# EAGLE schematic MEM_MUX_2W_1 (EAGLE 6.5.0)

## Sheet 1 of 12
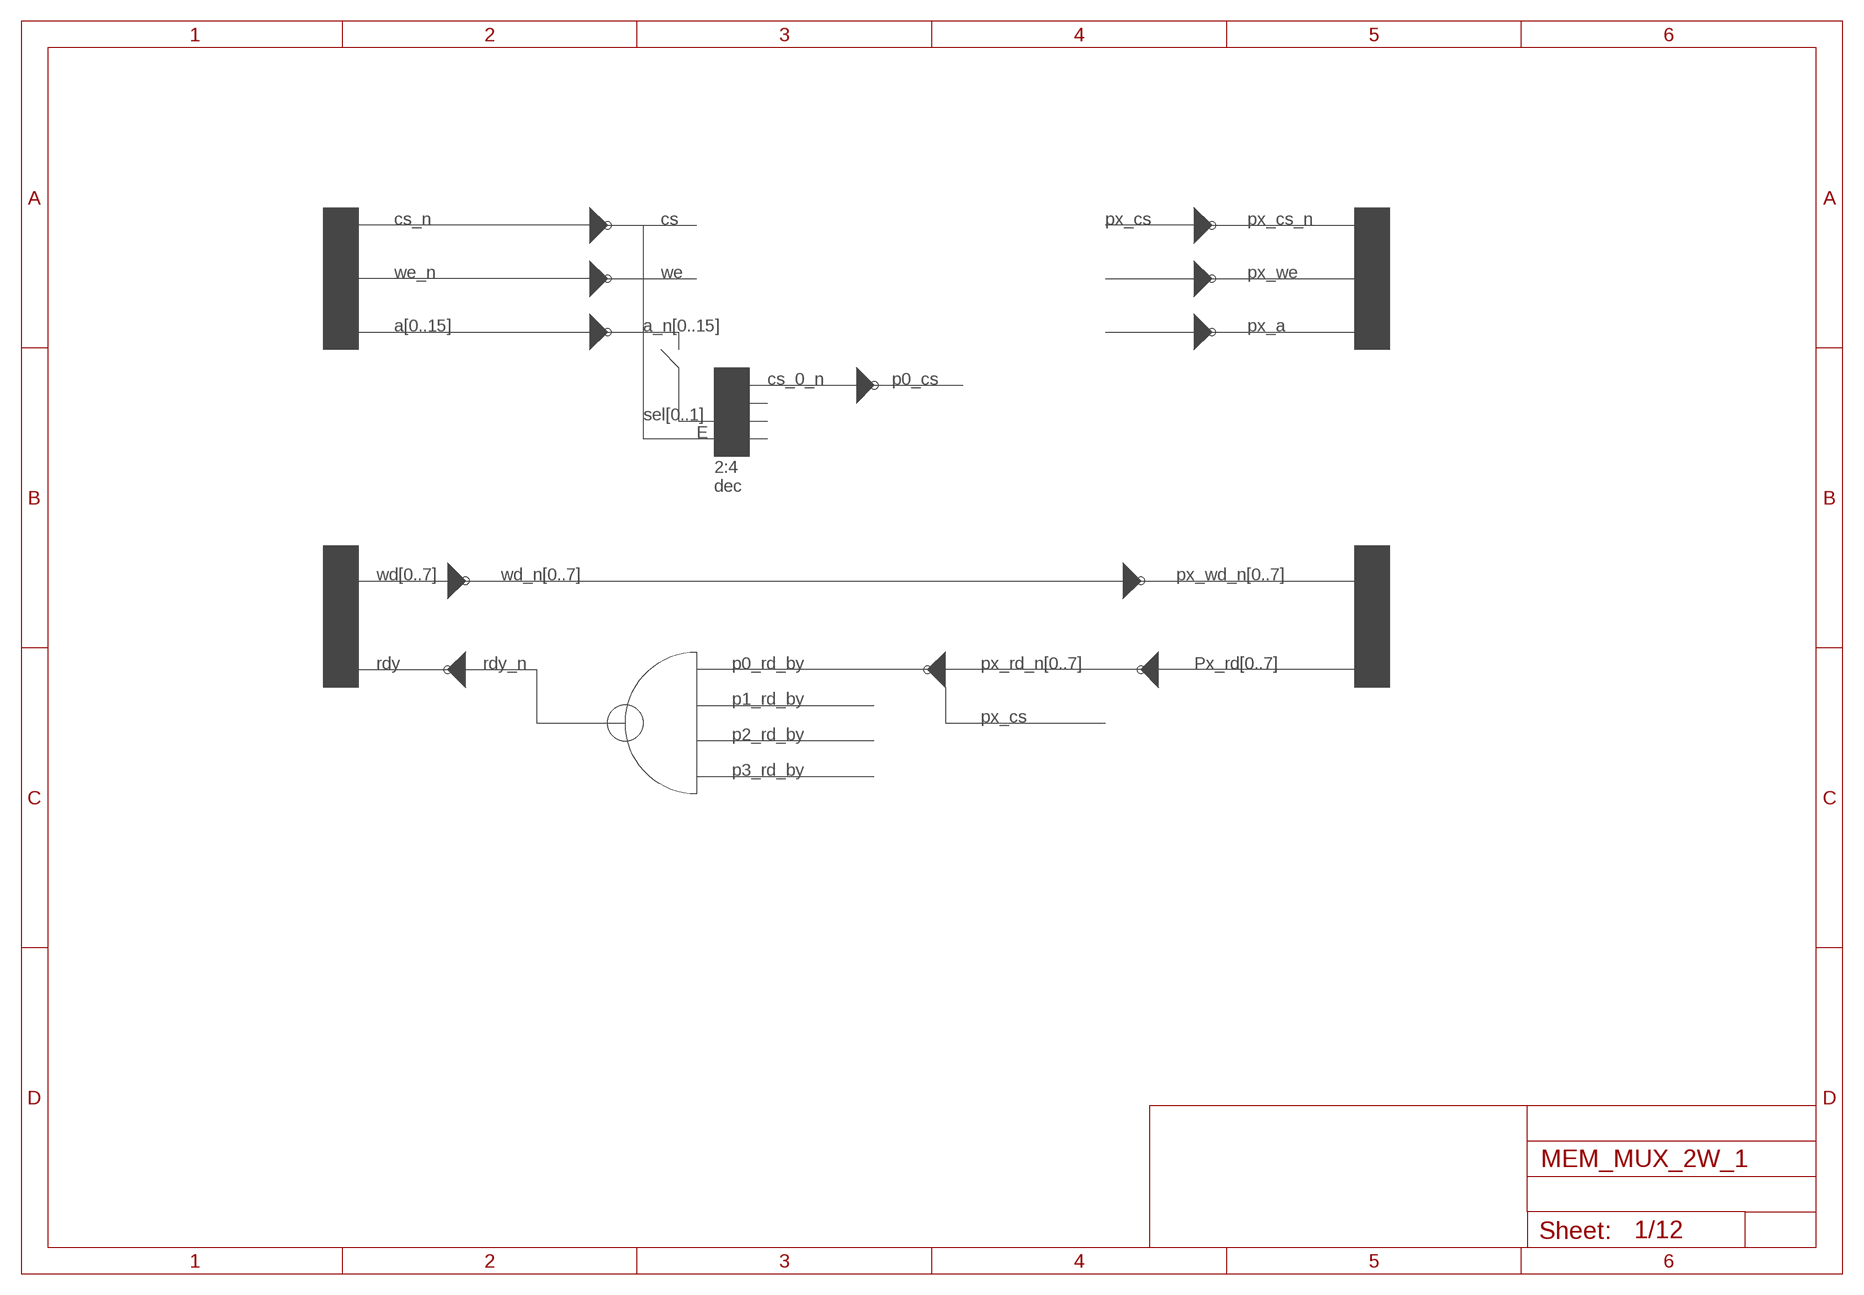
[diagram p0: schematic, sheet 1]

### Notes on the sheet
- cs_n | cs | px_cs | px_cs_n
- we_n | we | px_we
- a[0..15] | a_n[0..15] | px_a
- cs_0_n | p0_cs
- sel[0..1]
- E
- 2:4
  dec
- wd[0..7] | wd_n[0..7] | px_wd_n[0..7]
- rdy | rdy_n | p0_rd_by | px_rd_n[0..7] | Px_rd[0..7]
- p1_rd_by
- px_cs
- p2_rd_by
- p3_rd_by

## Sheet 2 of 12
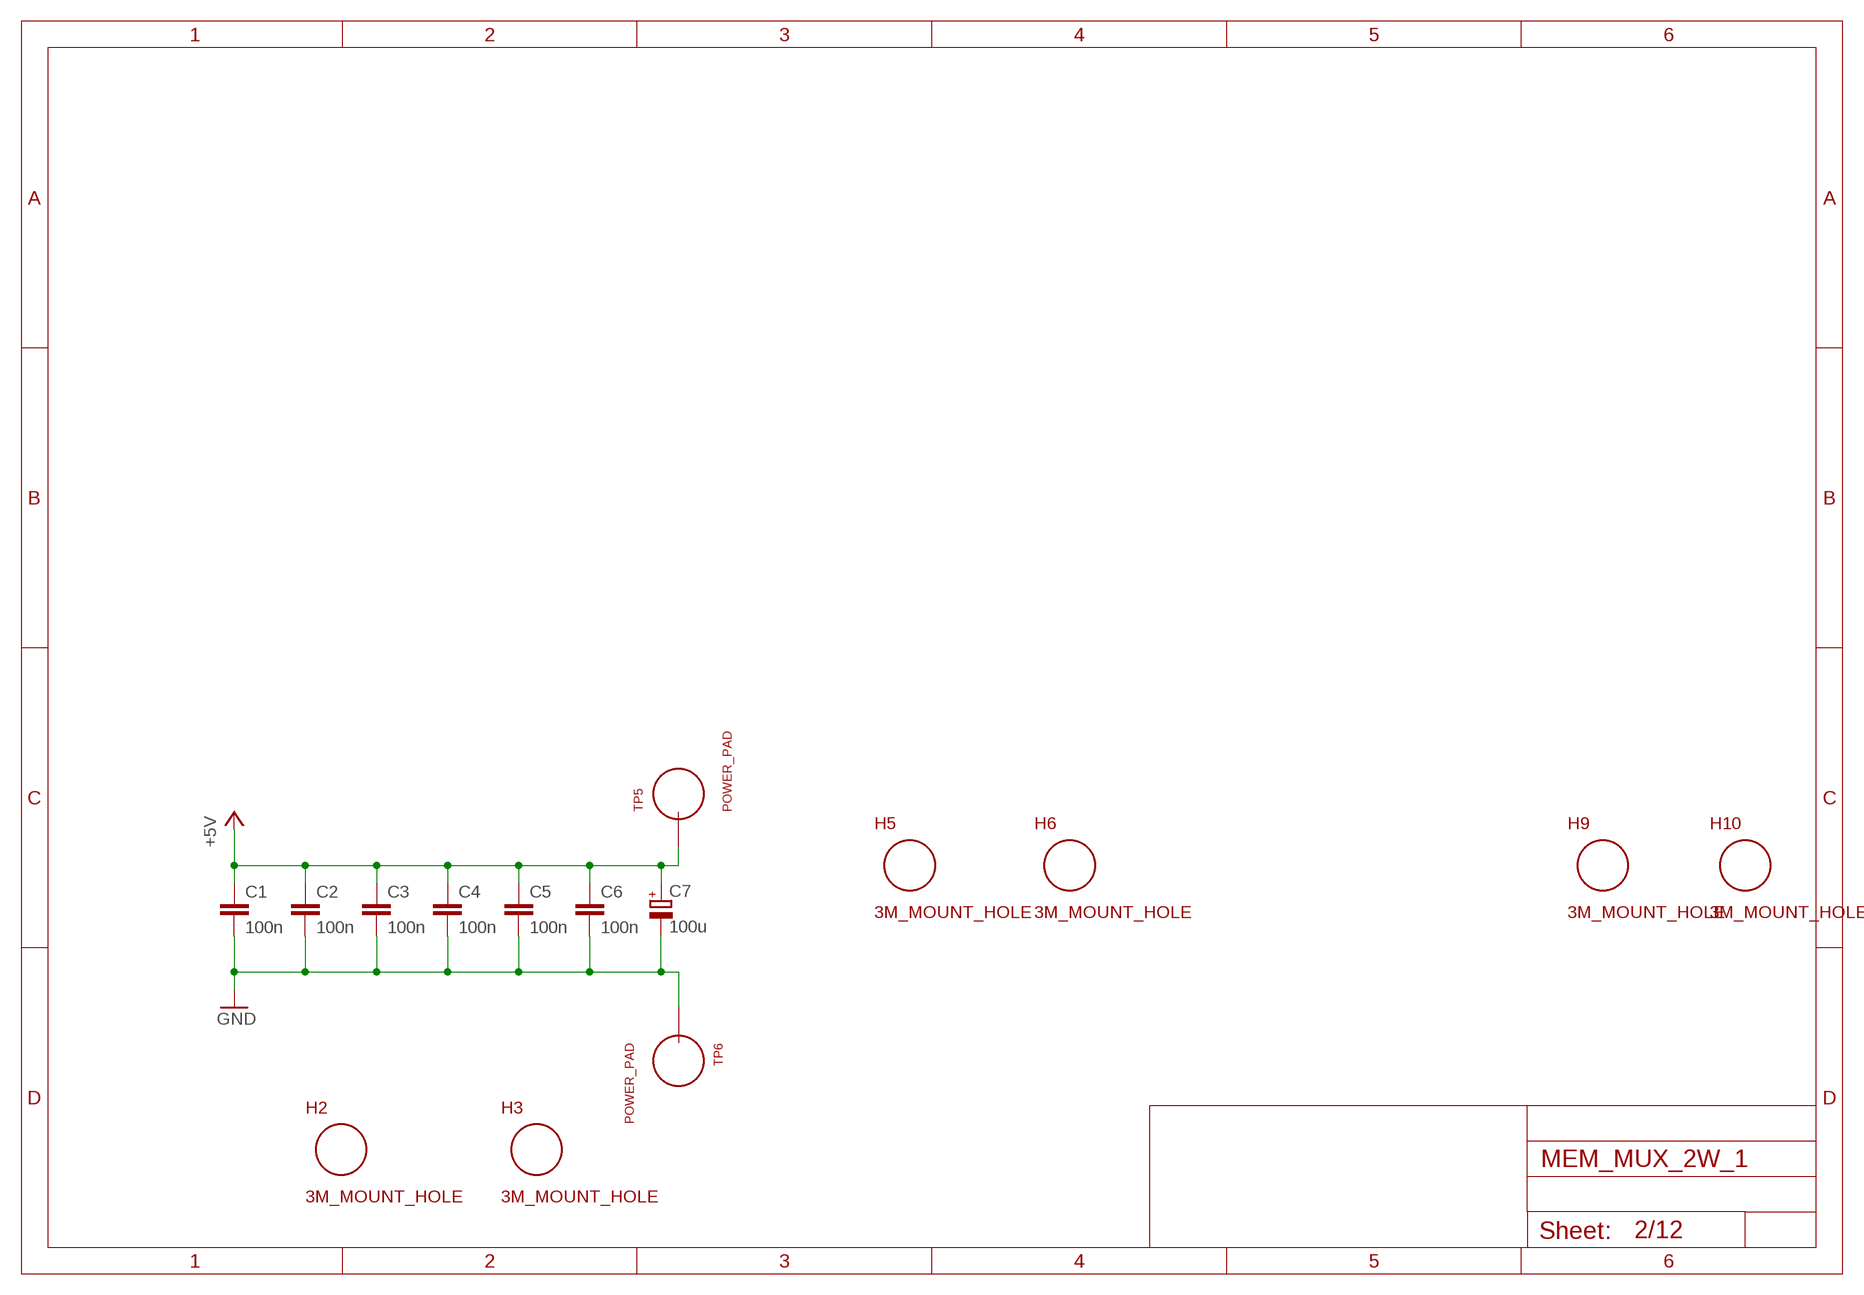
[diagram p1: schematic, sheet 2]

### Parts
C1  100n  C_P2INCH  [CAP_P2INCH]
C2  100n  C_P2INCH  [CAP_P2INCH]
C3  100n  C_P2INCH  [CAP_P2INCH]
C4  100n  C_P2INCH  [CAP_P2INCH]
C5  100n  C_P2INCH  [CAP_P2INCH]
C6  100n  C_P2INCH  [CAP_P2INCH]
C7  100u  POLARISED_CAP_2P5_6P3MM  [POLARISED_CAP_2P5_6P3MM]
H2  3M_MOUNT_HOLE  [3M_HOLE]
H3  3M_MOUNT_HOLE  [3M_HOLE]
H5  3M_MOUNT_HOLE  [3M_HOLE]
H6  3M_MOUNT_HOLE  [3M_HOLE]
H9  3M_MOUNT_HOLE  [3M_HOLE]
H10  3M_MOUNT_HOLE  [3M_HOLE]
TP5  POWER_PAD  [POWER_PAD]
TP6  POWER_PAD  [POWER_PAD]

### Nets
+5V: C1.1 C2.1 C3.1 C4.1 C5.1 C6.1 C7.A TP5.1 ; also sheet 3,4,5,6,7,8,9,10,11,12
GND: C1.2 C2.2 C3.2 C4.2 C5.2 C6.2 C7.K TP6.1 ; also sheet 3,4,5,6,7,8,9,10,11,12

## Sheet 3 of 12
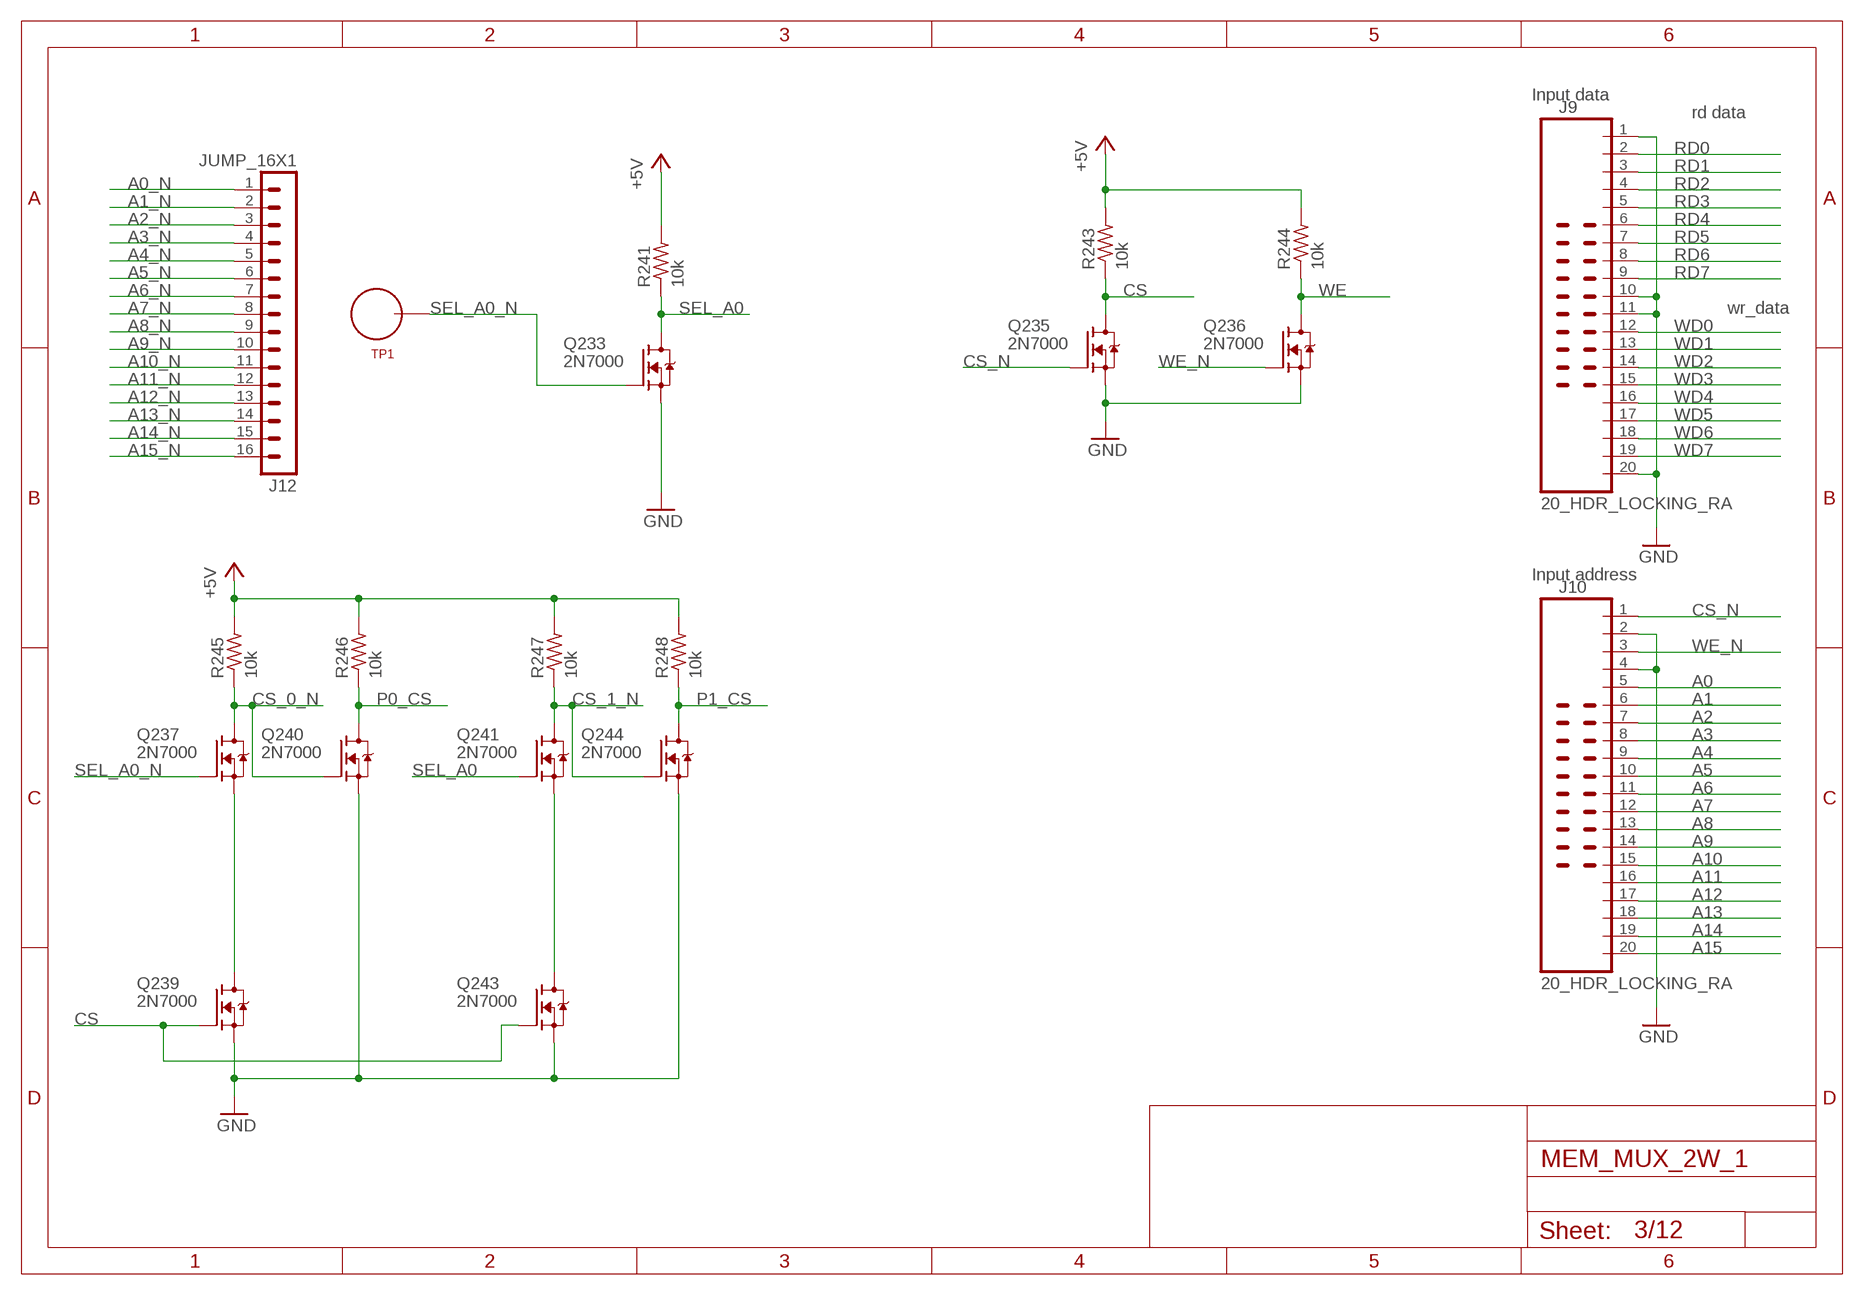
[diagram p2: schematic, sheet 3]

### Parts
J9  20_HDR_LOCKING_RA  [20_HDR_LOCKING_RA]
J10  20_HDR_LOCKING_RA  [20_HDR_LOCKING_RA]
J12  JUMP_16X1  [JUMP_16X1]
Q233  2N7000  [TO92-DGS]
Q235  2N7000  [TO92-DGS]
Q236  2N7000  [TO92-DGS]
Q237  2N7000  [TO92-DGS]
Q239  2N7000  [TO92-DGS]
Q240  2N7000  [TO92-DGS]
Q241  2N7000  [TO92-DGS]
Q243  2N7000  [TO92-DGS]
Q244  2N7000  [TO92-DGS]
R241  10k  R_P2INCH  [R_P2INCH]
R243  10k  R_P2INCH  [R_P2INCH]
R244  10k  R_P2INCH  [R_P2INCH]
R245  10k  R_P2INCH  [R_P2INCH]
R246  10k  R_P2INCH  [R_P2INCH]
R247  10k  R_P2INCH  [R_P2INCH]
R248  10k  R_P2INCH  [R_P2INCH]
TP1  TEST_LOOP  [TEST_LOOP]

### Nets
+5V: R241.2 R243.2 R244.2 R245.2 R246.2 R247.2 R248.2 ; also sheet 2,4,5,6,7,8,9,10,11,12
A0: J10.5 ; also sheet 4
A0_N: J12.1 ; also sheet 4,7,10
A1: J10.6 ; also sheet 4
A1_N: J12.2 ; also sheet 4,7,10
A2: J10.7 ; also sheet 4
A2_N: J12.3 ; also sheet 4,7,10
A3: J10.8 ; also sheet 4
A3_N: J12.4 ; also sheet 4,7,10
A4: J10.9 ; also sheet 4
A4_N: J12.5 ; also sheet 4,7,10
A5: J10.10 ; also sheet 4
A5_N: J12.6 ; also sheet 4,7,10
A6: J10.11 ; also sheet 4
A6_N: J12.7 ; also sheet 4,7,10
A7: J10.12 ; also sheet 4
A7_N: J12.8 ; also sheet 4,7,10
A8: J10.13 ; also sheet 4
A8_N: J12.9 ; also sheet 4,7,10
A9: J10.14 ; also sheet 4
A9_N: J12.10 ; also sheet 4,7,10
A10: J10.15 ; also sheet 4
A10_N: J12.11 ; also sheet 4,7,10
A11: J10.16 ; also sheet 4
A11_N: J12.12 ; also sheet 4,7,10
A12: J10.17 ; also sheet 4
A12_N: J12.13 ; also sheet 4,7,10
A13: J10.18 ; also sheet 4
A13_N: J12.14 ; also sheet 4,7,10
A14: J10.19 ; also sheet 4
A14_N: J12.15 ; also sheet 4,7,10
A15: J10.20 ; also sheet 4
A15_N: J12.16 ; also sheet 4,7,10
CS: Q235.D Q239.G Q243.G R243.1
CS_0_N: Q237.D Q240.G R245.1 ; also sheet 5
CS_1_N: Q241.D Q244.G R247.1 ; also sheet 8
CS_N: J10.1 Q235.G
GND: J9.1 J9.10 J9.11 J9.20 J10.2 J10.4 Q233.S Q235.S Q236.S Q239.S Q240.S Q243.S Q244.S ; also sheet 2,4,5,6,7,8,9,10,11,12
N$33: Q237.S Q239.D
N$34: Q241.S Q243.D
P0_CS: Q240.D R246.1 ; also sheet 6
P1_CS: Q244.D R248.1 ; also sheet 9
RD0: J9.2 ; also sheet 11
RD1: J9.3 ; also sheet 11
RD2: J9.4 ; also sheet 11
RD3: J9.5 ; also sheet 11
RD4: J9.6 ; also sheet 12
RD5: J9.7 ; also sheet 12
RD6: J9.8 ; also sheet 12
RD7: J9.9 ; also sheet 12
SEL_A0: Q233.D Q241.G R241.1
SEL_A0_N: Q233.G Q237.G TP1.P$1
WD0: J9.12 ; also sheet 4
WD1: J9.13 ; also sheet 4
WD2: J9.14 ; also sheet 4
WD3: J9.15 ; also sheet 4
WD4: J9.16 ; also sheet 4
WD5: J9.17 ; also sheet 4
WD6: J9.18 ; also sheet 4
WD7: J9.19 ; also sheet 4
WE: Q236.D R244.1 ; also sheet 6,9
WE_N: J10.3 Q236.G

### Notes on the sheet
- Input data
- rd data
- wr_data
- Input address

## Sheet 4 of 12
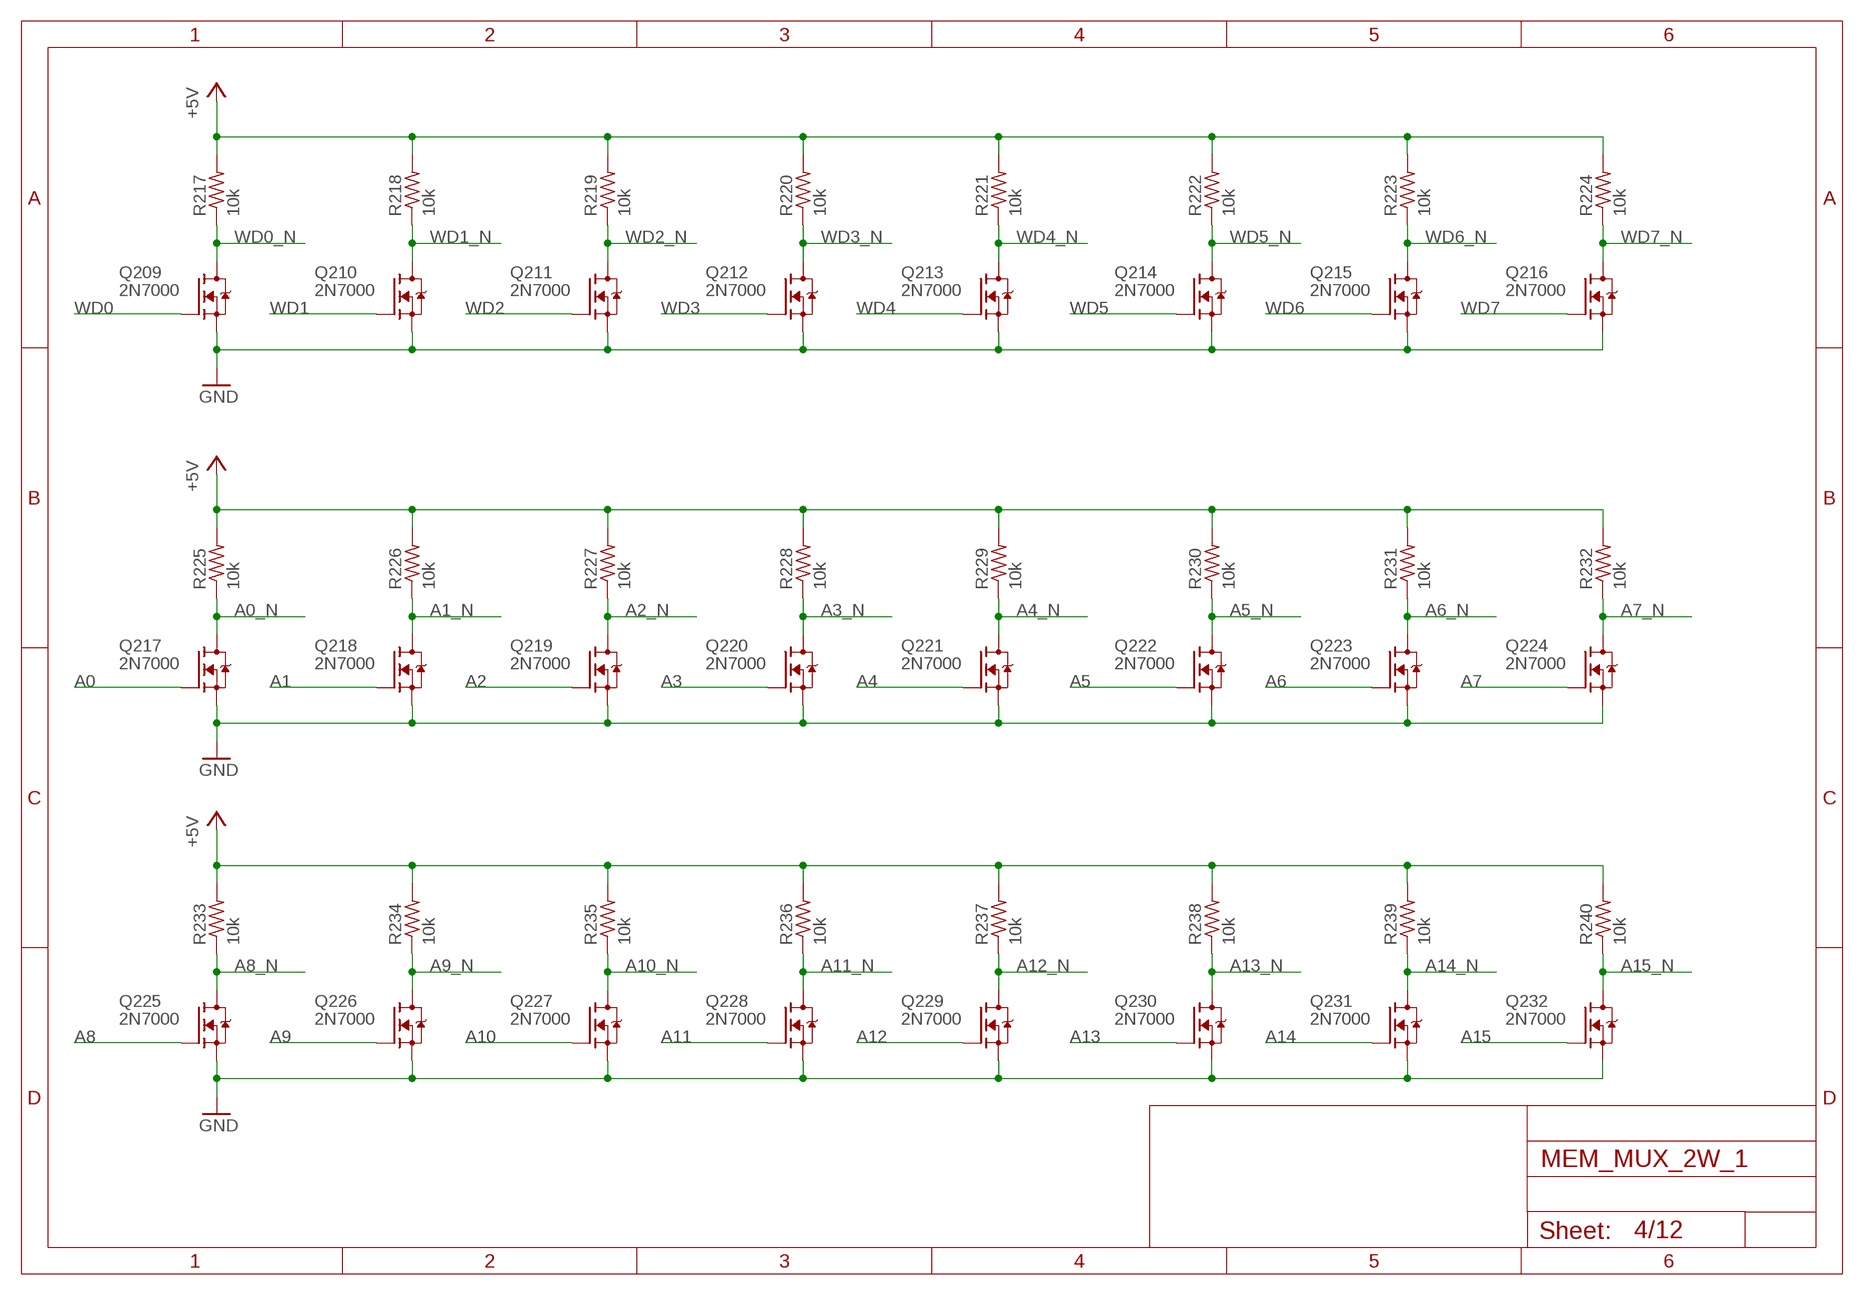
[diagram p3: schematic, sheet 4]

### Parts
Q209  2N7000  [TO92-DGS]
Q210  2N7000  [TO92-DGS]
Q211  2N7000  [TO92-DGS]
Q212  2N7000  [TO92-DGS]
Q213  2N7000  [TO92-DGS]
Q214  2N7000  [TO92-DGS]
Q215  2N7000  [TO92-DGS]
Q216  2N7000  [TO92-DGS]
Q217  2N7000  [TO92-DGS]
Q218  2N7000  [TO92-DGS]
Q219  2N7000  [TO92-DGS]
Q220  2N7000  [TO92-DGS]
Q221  2N7000  [TO92-DGS]
Q222  2N7000  [TO92-DGS]
Q223  2N7000  [TO92-DGS]
Q224  2N7000  [TO92-DGS]
Q225  2N7000  [TO92-DGS]
Q226  2N7000  [TO92-DGS]
Q227  2N7000  [TO92-DGS]
Q228  2N7000  [TO92-DGS]
Q229  2N7000  [TO92-DGS]
Q230  2N7000  [TO92-DGS]
Q231  2N7000  [TO92-DGS]
Q232  2N7000  [TO92-DGS]
R217  10k  R_P2INCH  [R_P2INCH]
R218  10k  R_P2INCH  [R_P2INCH]
R219  10k  R_P2INCH  [R_P2INCH]
R220  10k  R_P2INCH  [R_P2INCH]
R221  10k  R_P2INCH  [R_P2INCH]
R222  10k  R_P2INCH  [R_P2INCH]
R223  10k  R_P2INCH  [R_P2INCH]
R224  10k  R_P2INCH  [R_P2INCH]
R225  10k  R_P2INCH  [R_P2INCH]
R226  10k  R_P2INCH  [R_P2INCH]
R227  10k  R_P2INCH  [R_P2INCH]
R228  10k  R_P2INCH  [R_P2INCH]
R229  10k  R_P2INCH  [R_P2INCH]
R230  10k  R_P2INCH  [R_P2INCH]
R231  10k  R_P2INCH  [R_P2INCH]
R232  10k  R_P2INCH  [R_P2INCH]
R233  10k  R_P2INCH  [R_P2INCH]
R234  10k  R_P2INCH  [R_P2INCH]
R235  10k  R_P2INCH  [R_P2INCH]
R236  10k  R_P2INCH  [R_P2INCH]
R237  10k  R_P2INCH  [R_P2INCH]
R238  10k  R_P2INCH  [R_P2INCH]
R239  10k  R_P2INCH  [R_P2INCH]
R240  10k  R_P2INCH  [R_P2INCH]

### Nets
+5V: R217.2 R218.2 R219.2 R220.2 R221.2 R222.2 R223.2 R224.2 R225.2 R226.2 R227.2 R228.2 R229.2 R230.2 R231.2 R232.2 R233.2 R234.2 R235.2 R236.2 R237.2 R238.2 R239.2 R240.2 ; also sheet 2,3,5,6,7,8,9,10,11,12
A0: Q217.G ; also sheet 3
A0_N: Q217.D R225.1 ; also sheet 3,7,10
A1: Q218.G ; also sheet 3
A1_N: Q218.D R226.1 ; also sheet 3,7,10
A2: Q219.G ; also sheet 3
A2_N: Q219.D R227.1 ; also sheet 3,7,10
A3: Q220.G ; also sheet 3
A3_N: Q220.D R228.1 ; also sheet 3,7,10
A4: Q221.G ; also sheet 3
A4_N: Q221.D R229.1 ; also sheet 3,7,10
A5: Q222.G ; also sheet 3
A5_N: Q222.D R230.1 ; also sheet 3,7,10
A6: Q223.G ; also sheet 3
A6_N: Q223.D R231.1 ; also sheet 3,7,10
A7: Q224.G ; also sheet 3
A7_N: Q224.D R232.1 ; also sheet 3,7,10
A8: Q225.G ; also sheet 3
A8_N: Q225.D R233.1 ; also sheet 3,7,10
A9: Q226.G ; also sheet 3
A9_N: Q226.D R234.1 ; also sheet 3,7,10
A10: Q227.G ; also sheet 3
A10_N: Q227.D R235.1 ; also sheet 3,7,10
A11: Q228.G ; also sheet 3
A11_N: Q228.D R236.1 ; also sheet 3,7,10
A12: Q229.G ; also sheet 3
A12_N: Q229.D R237.1 ; also sheet 3,7,10
A13: Q230.G ; also sheet 3
A13_N: Q230.D R238.1 ; also sheet 3,7,10
A14: Q231.G ; also sheet 3
A14_N: Q231.D R239.1 ; also sheet 3,7,10
A15: Q232.G ; also sheet 3
A15_N: Q232.D R240.1 ; also sheet 3,7,10
GND: Q209.S Q210.S Q211.S Q212.S Q213.S Q214.S Q215.S Q216.S Q217.S Q218.S Q219.S Q220.S Q221.S Q222.S Q223.S Q224.S Q225.S Q226.S Q227.S Q228.S Q229.S Q230.S Q231.S Q232.S ; also sheet 2,3,5,6,7,8,9,10,11,12
WD0: Q209.G ; also sheet 3
WD0_N: Q209.D R217.1 ; also sheet 7,10
WD1: Q210.G ; also sheet 3
WD1_N: Q210.D R218.1 ; also sheet 7,10
WD2: Q211.G ; also sheet 3
WD2_N: Q211.D R219.1 ; also sheet 7,10
WD3: Q212.G ; also sheet 3
WD3_N: Q212.D R220.1 ; also sheet 7,10
WD4: Q213.G ; also sheet 3
WD4_N: Q213.D R221.1 ; also sheet 7,10
WD5: Q214.G ; also sheet 3
WD5_N: Q214.D R222.1 ; also sheet 7,10
WD6: Q215.G ; also sheet 3
WD6_N: Q215.D R223.1 ; also sheet 7,10
WD7: Q216.G ; also sheet 3
WD7_N: Q216.D R224.1 ; also sheet 7,10

## Sheet 5 of 12
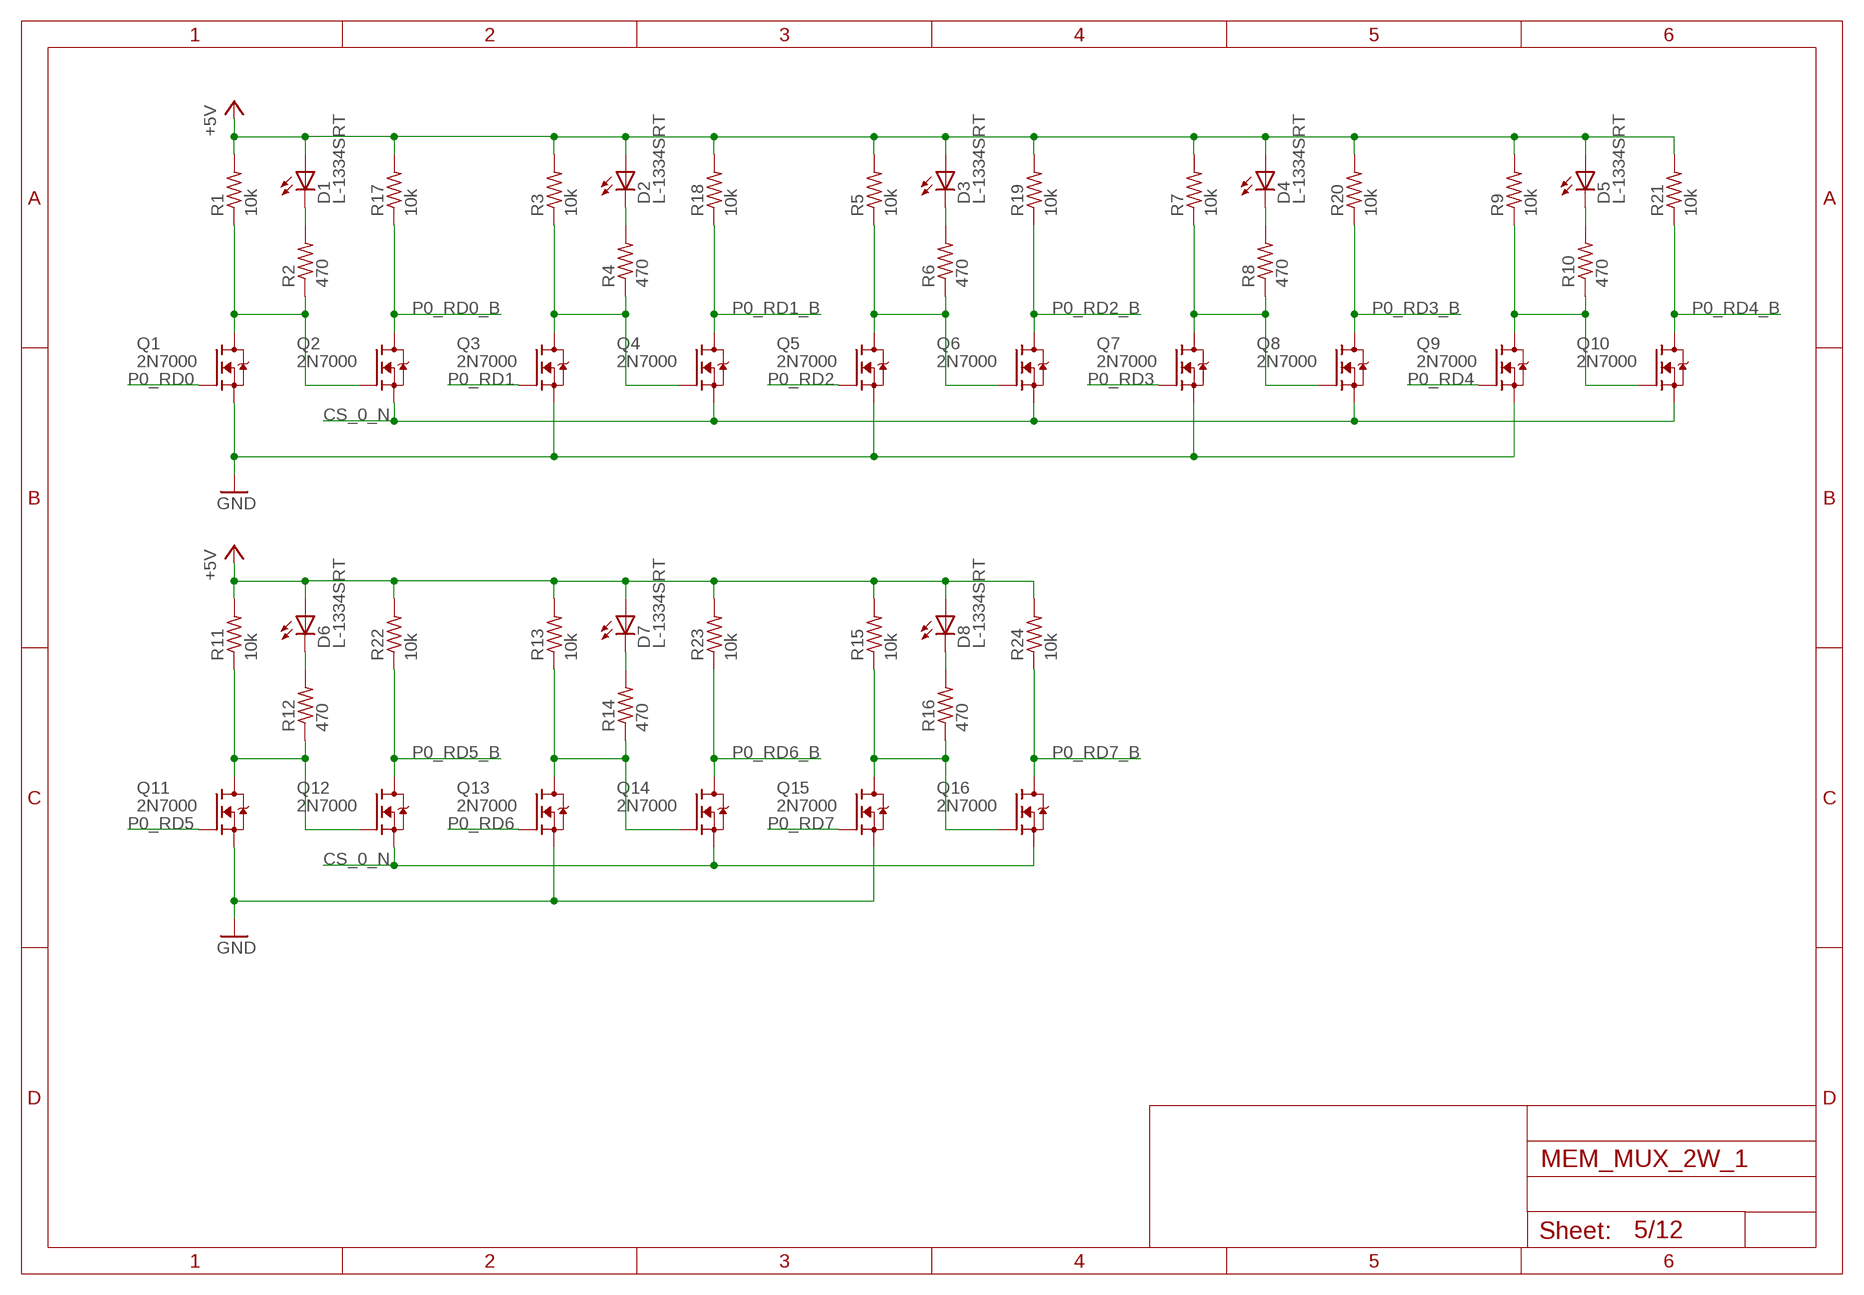
[diagram p4: schematic, sheet 5]

### Parts
D1  L-1334SRT  [LED3MM]
D2  L-1334SRT  [LED3MM]
D3  L-1334SRT  [LED3MM]
D4  L-1334SRT  [LED3MM]
D5  L-1334SRT  [LED3MM]
D6  L-1334SRT  [LED3MM]
D7  L-1334SRT  [LED3MM]
D8  L-1334SRT  [LED3MM]
Q1  2N7000  [TO92-DGS]
Q2  2N7000  [TO92-DGS]
Q3  2N7000  [TO92-DGS]
Q4  2N7000  [TO92-DGS]
Q5  2N7000  [TO92-DGS]
Q6  2N7000  [TO92-DGS]
Q7  2N7000  [TO92-DGS]
Q8  2N7000  [TO92-DGS]
Q9  2N7000  [TO92-DGS]
Q10  2N7000  [TO92-DGS]
Q11  2N7000  [TO92-DGS]
Q12  2N7000  [TO92-DGS]
Q13  2N7000  [TO92-DGS]
Q14  2N7000  [TO92-DGS]
Q15  2N7000  [TO92-DGS]
Q16  2N7000  [TO92-DGS]
R1  10k  R_P2INCH  [R_P2INCH]
R2  470  R_P2INCH  [R_P2INCH]
R3  10k  R_P2INCH  [R_P2INCH]
R4  470  R_P2INCH  [R_P2INCH]
R5  10k  R_P2INCH  [R_P2INCH]
R6  470  R_P2INCH  [R_P2INCH]
R7  10k  R_P2INCH  [R_P2INCH]
R8  470  R_P2INCH  [R_P2INCH]
R9  10k  R_P2INCH  [R_P2INCH]
R10  470  R_P2INCH  [R_P2INCH]
R11  10k  R_P2INCH  [R_P2INCH]
R12  470  R_P2INCH  [R_P2INCH]
R13  10k  R_P2INCH  [R_P2INCH]
R14  470  R_P2INCH  [R_P2INCH]
R15  10k  R_P2INCH  [R_P2INCH]
R16  470  R_P2INCH  [R_P2INCH]
R17  10k  R_P2INCH  [R_P2INCH]
R18  10k  R_P2INCH  [R_P2INCH]
R19  10k  R_P2INCH  [R_P2INCH]
R20  10k  R_P2INCH  [R_P2INCH]
R21  10k  R_P2INCH  [R_P2INCH]
R22  10k  R_P2INCH  [R_P2INCH]
R23  10k  R_P2INCH  [R_P2INCH]
R24  10k  R_P2INCH  [R_P2INCH]

### Nets
+5V: D1.A D2.A D3.A D4.A D5.A D6.A D7.A D8.A R1.2 R3.2 R5.2 R7.2 R9.2 R11.2 R13.2 R15.2 R17.2 R18.2 R19.2 R20.2 R21.2 R22.2 R23.2 R24.2 ; also sheet 2,3,4,6,7,8,9,10,11,12
CS_0_N: Q2.S Q4.S Q6.S Q8.S Q10.S Q12.S Q14.S Q16.S ; also sheet 3
GND: Q1.S Q3.S Q5.S Q7.S Q9.S Q11.S Q13.S Q15.S ; also sheet 2,3,4,6,7,8,9,10,11,12
N$1: Q3.D Q4.G R3.1 R4.1
N$2: Q1.D Q2.G R1.1 R2.1
N$3: D1.K(C) R2.2
N$4: D2.K(C) R4.2
N$5: Q5.D Q6.G R5.1 R6.1
N$6: D3.K(C) R6.2
N$7: Q7.D Q8.G R7.1 R8.1
N$8: D4.K(C) R8.2
N$9: Q9.D Q10.G R9.1 R10.1
N$10: D5.K(C) R10.2
N$12: Q11.D Q12.G R11.1 R12.1
N$13: D6.K(C) R12.2
N$14: Q13.D Q14.G R13.1 R14.1
N$15: D7.K(C) R14.2
N$16: Q15.D Q16.G R15.1 R16.1
N$17: D8.K(C) R16.2
P0_RD0: Q1.G ; also sheet 6
P0_RD0_B: Q2.D R17.1 ; also sheet 11
P0_RD1: Q3.G ; also sheet 6
P0_RD1_B: Q4.D R18.1 ; also sheet 11
P0_RD2: Q5.G ; also sheet 6
P0_RD2_B: Q6.D R19.1 ; also sheet 11
P0_RD3: Q7.G ; also sheet 6
P0_RD3_B: Q8.D R20.1 ; also sheet 11
P0_RD4: Q9.G ; also sheet 6
P0_RD4_B: Q10.D R21.1 ; also sheet 12
P0_RD5: Q11.G ; also sheet 6
P0_RD5_B: Q12.D R22.1 ; also sheet 12
P0_RD6: Q13.G ; also sheet 6
P0_RD6_B: Q14.D R23.1 ; also sheet 12
P0_RD7: Q15.G ; also sheet 6
P0_RD7_B: Q16.D R24.1 ; also sheet 12

## Sheet 6 of 12
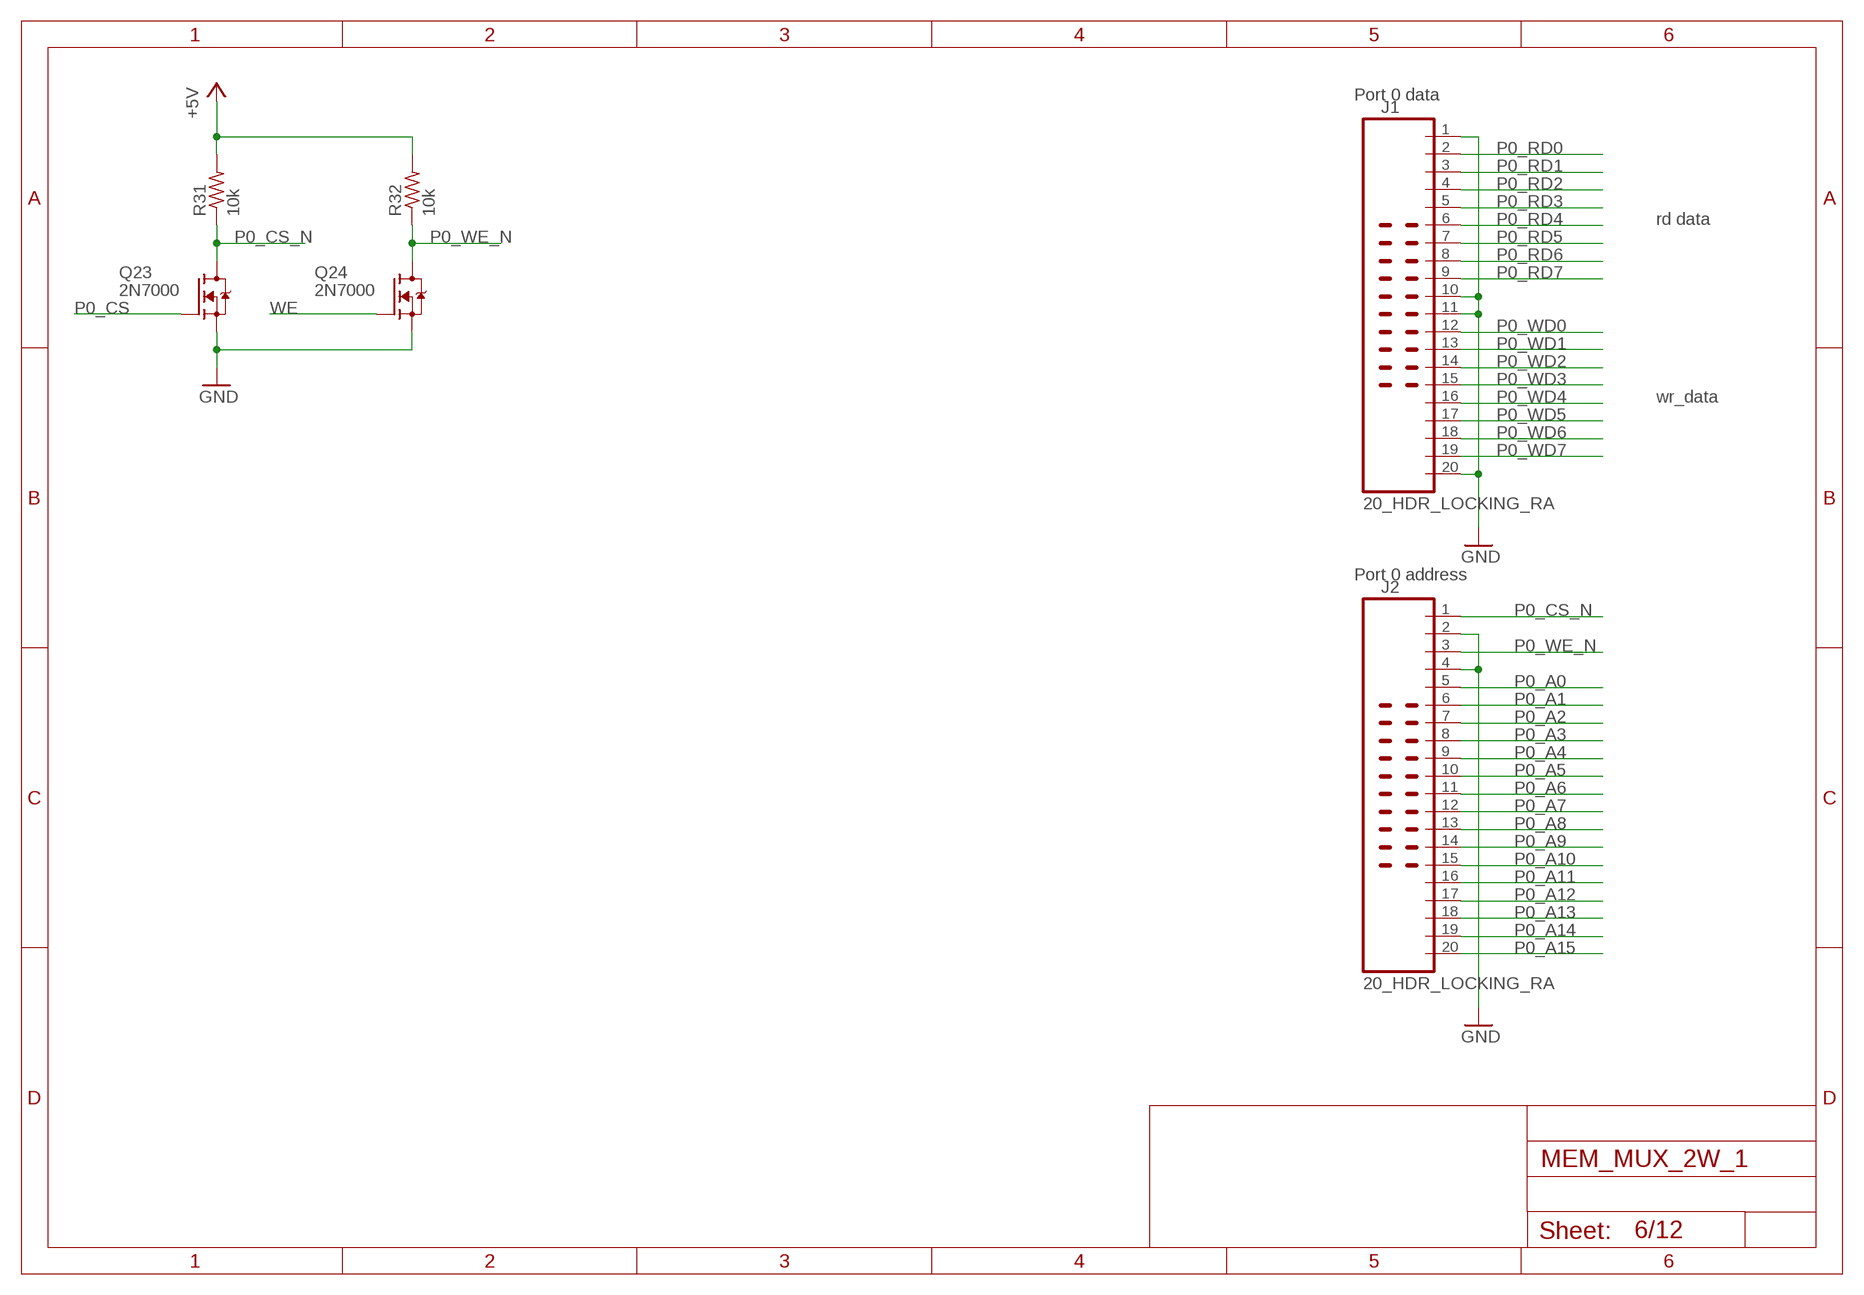
[diagram p5: schematic, sheet 6]

### Parts
J1  20_HDR_LOCKING_RA  [20_HDR_LOCKING_RA]
J2  20_HDR_LOCKING_RA  [20_HDR_LOCKING_RA]
Q23  2N7000  [TO92-DGS]
Q24  2N7000  [TO92-DGS]
R31  10k  R_P2INCH  [R_P2INCH]
R32  10k  R_P2INCH  [R_P2INCH]

### Nets
+5V: R31.2 R32.2 ; also sheet 2,3,4,5,7,8,9,10,11,12
GND: J1.1 J1.10 J1.11 J1.20 J2.2 J2.4 Q23.S Q24.S ; also sheet 2,3,4,5,7,8,9,10,11,12
P0_A0: J2.5 ; also sheet 7
P0_A1: J2.6 ; also sheet 7
P0_A2: J2.7 ; also sheet 7
P0_A3: J2.8 ; also sheet 7
P0_A4: J2.9 ; also sheet 7
P0_A5: J2.10 ; also sheet 7
P0_A6: J2.11 ; also sheet 7
P0_A7: J2.12 ; also sheet 7
P0_A8: J2.13 ; also sheet 7
P0_A9: J2.14 ; also sheet 7
P0_A10: J2.15 ; also sheet 7
P0_A11: J2.16 ; also sheet 7
P0_A12: J2.17 ; also sheet 7
P0_A13: J2.18 ; also sheet 7
P0_A14: J2.19 ; also sheet 7
P0_A15: J2.20 ; also sheet 7
P0_CS: Q23.G ; also sheet 3
P0_CS_N: J2.1 Q23.D R31.1
P0_RD0: J1.2 ; also sheet 5
P0_RD1: J1.3 ; also sheet 5
P0_RD2: J1.4 ; also sheet 5
P0_RD3: J1.5 ; also sheet 5
P0_RD4: J1.6 ; also sheet 5
P0_RD5: J1.7 ; also sheet 5
P0_RD6: J1.8 ; also sheet 5
P0_RD7: J1.9 ; also sheet 5
P0_WD0: J1.12 ; also sheet 7
P0_WD1: J1.13 ; also sheet 7
P0_WD2: J1.14 ; also sheet 7
P0_WD3: J1.15 ; also sheet 7
P0_WD4: J1.16 ; also sheet 7
P0_WD5: J1.17 ; also sheet 7
P0_WD6: J1.18 ; also sheet 7
P0_WD7: J1.19 ; also sheet 7
P0_WE_N: J2.3 Q24.D R32.1
WE: Q24.G ; also sheet 3,9

### Notes on the sheet
- Port 0 data
- rd data
- wr_data
- Port 0 address

## Sheet 7 of 12
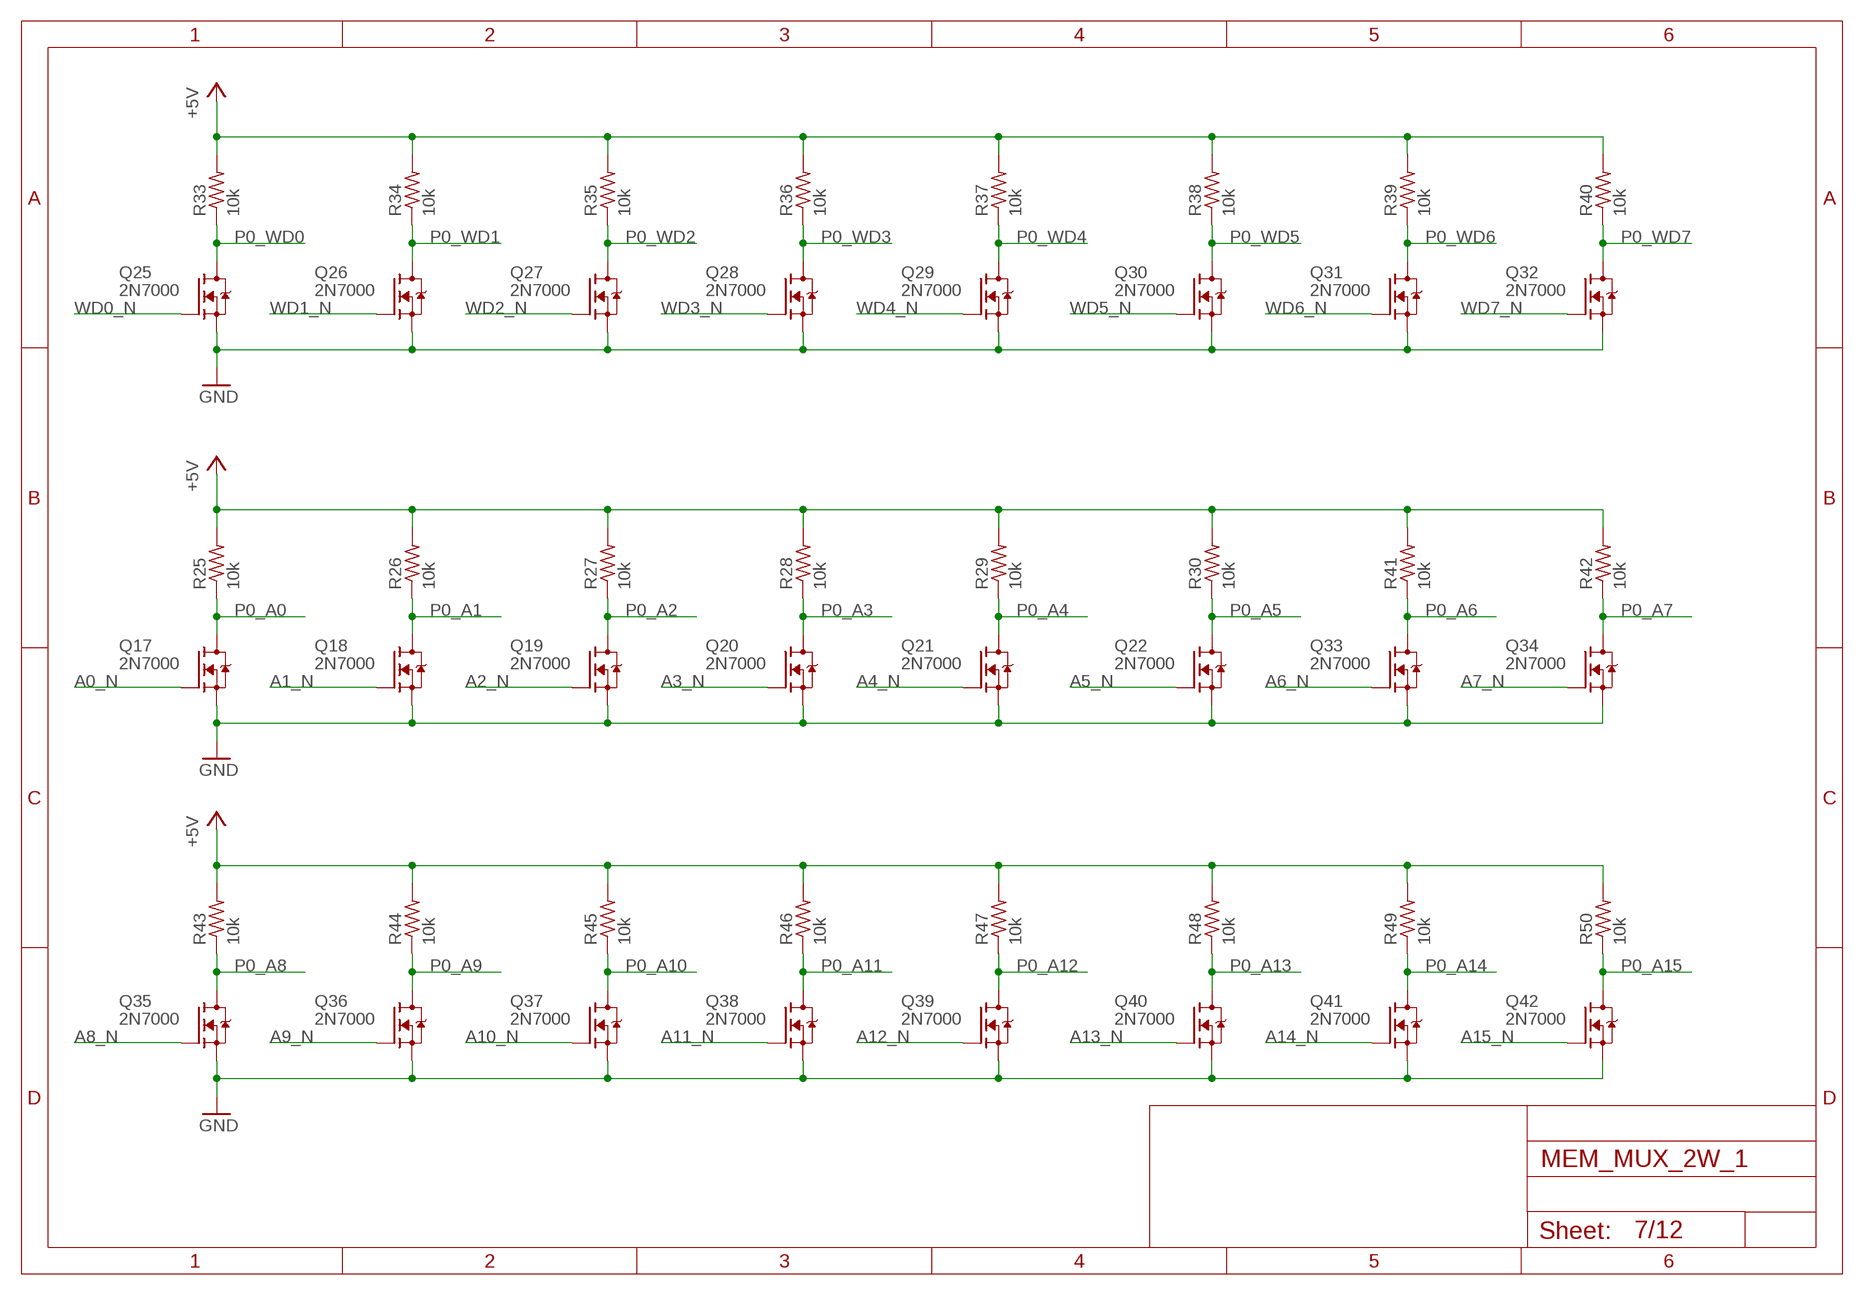
[diagram p6: schematic, sheet 7]

### Parts
Q17  2N7000  [TO92-DGS]
Q18  2N7000  [TO92-DGS]
Q19  2N7000  [TO92-DGS]
Q20  2N7000  [TO92-DGS]
Q21  2N7000  [TO92-DGS]
Q22  2N7000  [TO92-DGS]
Q25  2N7000  [TO92-DGS]
Q26  2N7000  [TO92-DGS]
Q27  2N7000  [TO92-DGS]
Q28  2N7000  [TO92-DGS]
Q29  2N7000  [TO92-DGS]
Q30  2N7000  [TO92-DGS]
Q31  2N7000  [TO92-DGS]
Q32  2N7000  [TO92-DGS]
Q33  2N7000  [TO92-DGS]
Q34  2N7000  [TO92-DGS]
Q35  2N7000  [TO92-DGS]
Q36  2N7000  [TO92-DGS]
Q37  2N7000  [TO92-DGS]
Q38  2N7000  [TO92-DGS]
Q39  2N7000  [TO92-DGS]
Q40  2N7000  [TO92-DGS]
Q41  2N7000  [TO92-DGS]
Q42  2N7000  [TO92-DGS]
R25  10k  R_P2INCH  [R_P2INCH]
R26  10k  R_P2INCH  [R_P2INCH]
R27  10k  R_P2INCH  [R_P2INCH]
R28  10k  R_P2INCH  [R_P2INCH]
R29  10k  R_P2INCH  [R_P2INCH]
R30  10k  R_P2INCH  [R_P2INCH]
R33  10k  R_P2INCH  [R_P2INCH]
R34  10k  R_P2INCH  [R_P2INCH]
R35  10k  R_P2INCH  [R_P2INCH]
R36  10k  R_P2INCH  [R_P2INCH]
R37  10k  R_P2INCH  [R_P2INCH]
R38  10k  R_P2INCH  [R_P2INCH]
R39  10k  R_P2INCH  [R_P2INCH]
R40  10k  R_P2INCH  [R_P2INCH]
R41  10k  R_P2INCH  [R_P2INCH]
R42  10k  R_P2INCH  [R_P2INCH]
R43  10k  R_P2INCH  [R_P2INCH]
R44  10k  R_P2INCH  [R_P2INCH]
R45  10k  R_P2INCH  [R_P2INCH]
R46  10k  R_P2INCH  [R_P2INCH]
R47  10k  R_P2INCH  [R_P2INCH]
R48  10k  R_P2INCH  [R_P2INCH]
R49  10k  R_P2INCH  [R_P2INCH]
R50  10k  R_P2INCH  [R_P2INCH]

### Nets
+5V: R25.2 R26.2 R27.2 R28.2 R29.2 R30.2 R33.2 R34.2 R35.2 R36.2 R37.2 R38.2 R39.2 R40.2 R41.2 R42.2 R43.2 R44.2 R45.2 R46.2 R47.2 R48.2 R49.2 R50.2 ; also sheet 2,3,4,5,6,8,9,10,11,12
A0_N: Q17.G ; also sheet 3,4,10
A1_N: Q18.G ; also sheet 3,4,10
A2_N: Q19.G ; also sheet 3,4,10
A3_N: Q20.G ; also sheet 3,4,10
A4_N: Q21.G ; also sheet 3,4,10
A5_N: Q22.G ; also sheet 3,4,10
A6_N: Q33.G ; also sheet 3,4,10
A7_N: Q34.G ; also sheet 3,4,10
A8_N: Q35.G ; also sheet 3,4,10
A9_N: Q36.G ; also sheet 3,4,10
A10_N: Q37.G ; also sheet 3,4,10
A11_N: Q38.G ; also sheet 3,4,10
A12_N: Q39.G ; also sheet 3,4,10
A13_N: Q40.G ; also sheet 3,4,10
A14_N: Q41.G ; also sheet 3,4,10
A15_N: Q42.G ; also sheet 3,4,10
GND: Q17.S Q18.S Q19.S Q20.S Q21.S Q22.S Q25.S Q26.S Q27.S Q28.S Q29.S Q30.S Q31.S Q32.S Q33.S Q34.S Q35.S Q36.S Q37.S Q38.S Q39.S Q40.S Q41.S Q42.S ; also sheet 2,3,4,5,6,8,9,10,11,12
P0_A0: Q17.D R25.1 ; also sheet 6
P0_A1: Q18.D R26.1 ; also sheet 6
P0_A2: Q19.D R27.1 ; also sheet 6
P0_A3: Q20.D R28.1 ; also sheet 6
P0_A4: Q21.D R29.1 ; also sheet 6
P0_A5: Q22.D R30.1 ; also sheet 6
P0_A6: Q33.D R41.1 ; also sheet 6
P0_A7: Q34.D R42.1 ; also sheet 6
P0_A8: Q35.D R43.1 ; also sheet 6
P0_A9: Q36.D R44.1 ; also sheet 6
P0_A10: Q37.D R45.1 ; also sheet 6
P0_A11: Q38.D R46.1 ; also sheet 6
P0_A12: Q39.D R47.1 ; also sheet 6
P0_A13: Q40.D R48.1 ; also sheet 6
P0_A14: Q41.D R49.1 ; also sheet 6
P0_A15: Q42.D R50.1 ; also sheet 6
P0_WD0: Q25.D R33.1 ; also sheet 6
P0_WD1: Q26.D R34.1 ; also sheet 6
P0_WD2: Q27.D R35.1 ; also sheet 6
P0_WD3: Q28.D R36.1 ; also sheet 6
P0_WD4: Q29.D R37.1 ; also sheet 6
P0_WD5: Q30.D R38.1 ; also sheet 6
P0_WD6: Q31.D R39.1 ; also sheet 6
P0_WD7: Q32.D R40.1 ; also sheet 6
WD0_N: Q25.G ; also sheet 4,10
WD1_N: Q26.G ; also sheet 4,10
WD2_N: Q27.G ; also sheet 4,10
WD3_N: Q28.G ; also sheet 4,10
WD4_N: Q29.G ; also sheet 4,10
WD5_N: Q30.G ; also sheet 4,10
WD6_N: Q31.G ; also sheet 4,10
WD7_N: Q32.G ; also sheet 4,10

## Sheet 8 of 12
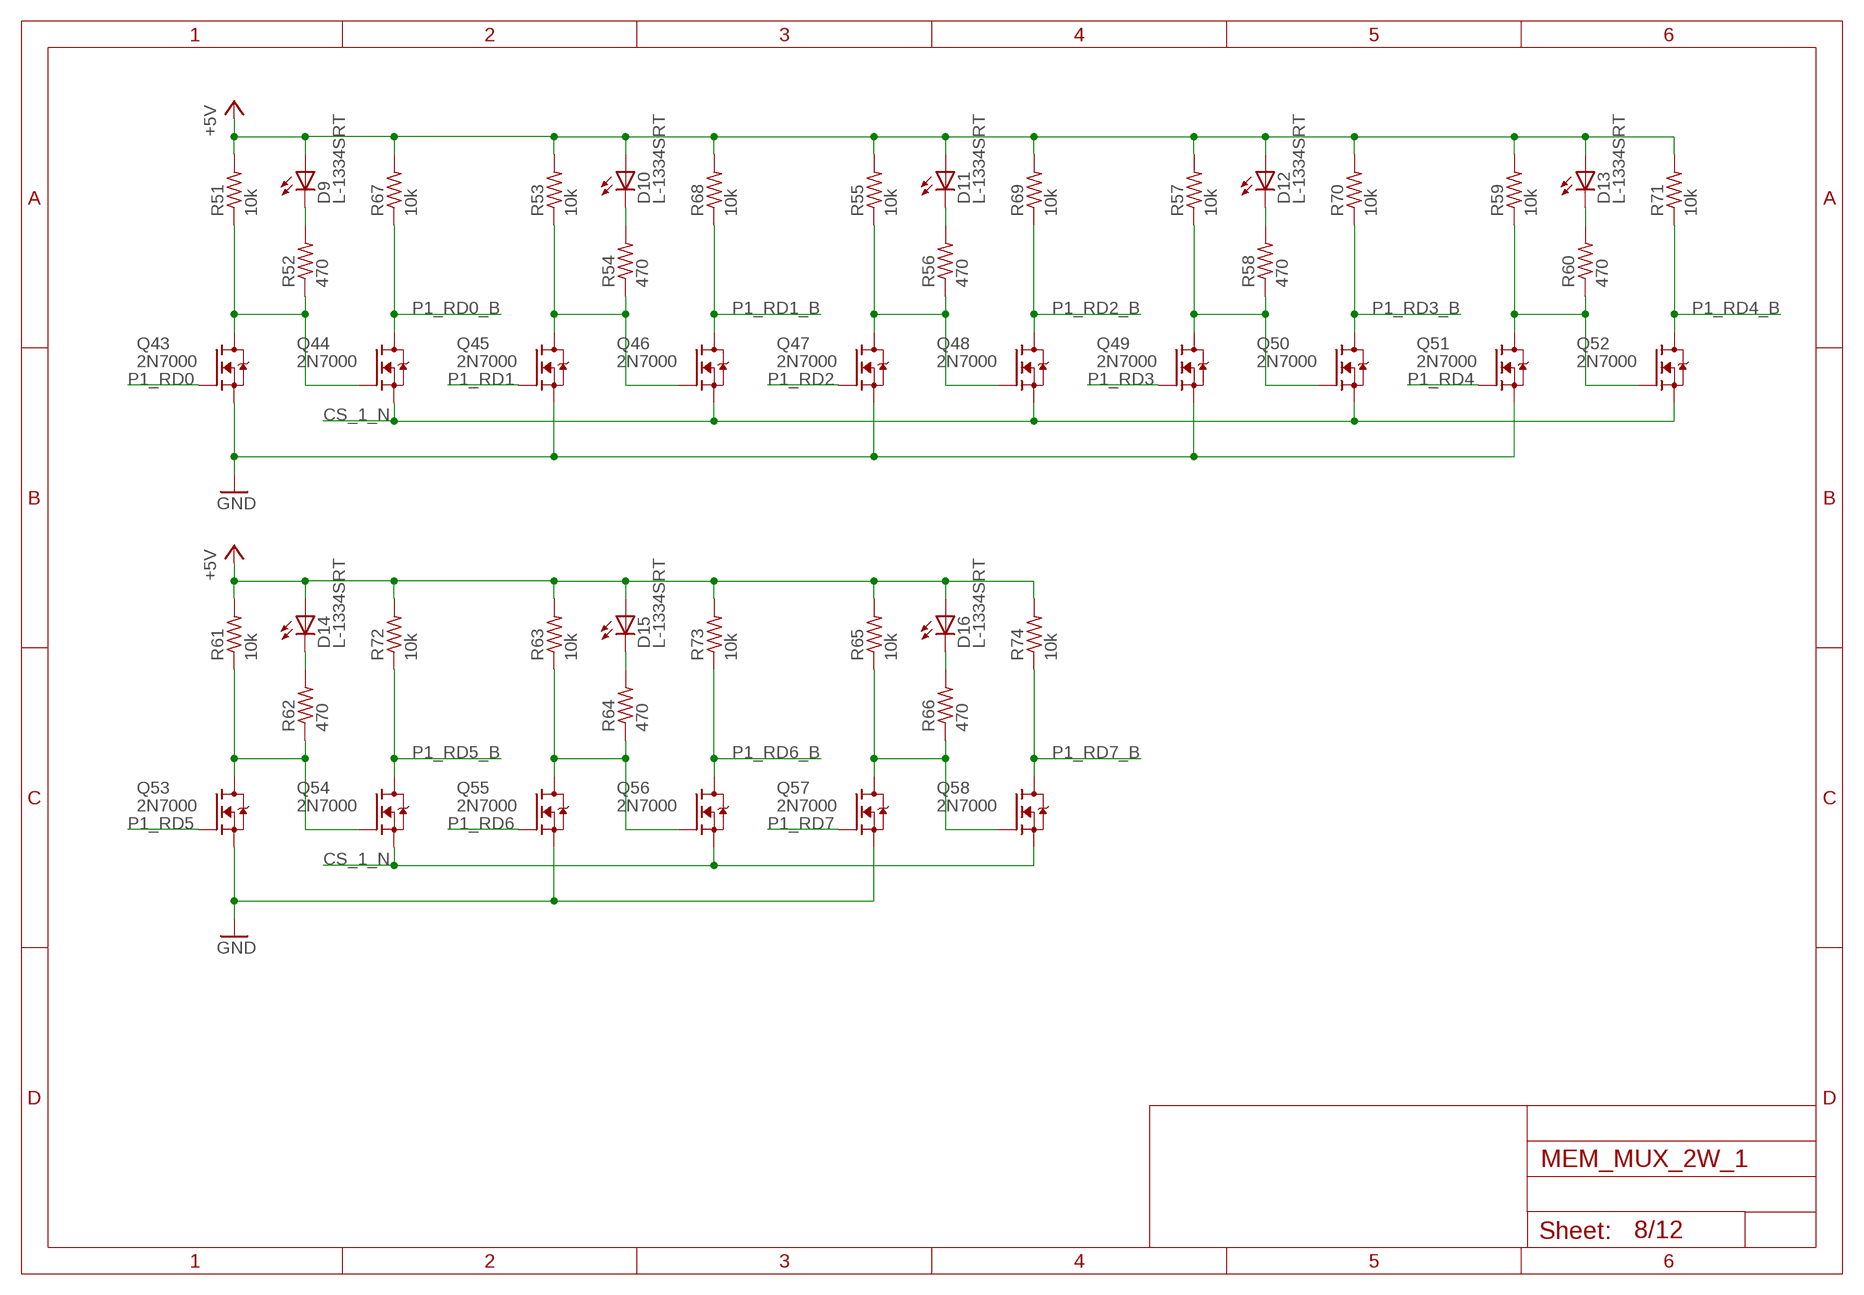
[diagram p7: schematic, sheet 8]

### Parts
D9  L-1334SRT  [LED3MM]
D10  L-1334SRT  [LED3MM]
D11  L-1334SRT  [LED3MM]
D12  L-1334SRT  [LED3MM]
D13  L-1334SRT  [LED3MM]
D14  L-1334SRT  [LED3MM]
D15  L-1334SRT  [LED3MM]
D16  L-1334SRT  [LED3MM]
Q43  2N7000  [TO92-DGS]
Q44  2N7000  [TO92-DGS]
Q45  2N7000  [TO92-DGS]
Q46  2N7000  [TO92-DGS]
Q47  2N7000  [TO92-DGS]
Q48  2N7000  [TO92-DGS]
Q49  2N7000  [TO92-DGS]
Q50  2N7000  [TO92-DGS]
Q51  2N7000  [TO92-DGS]
Q52  2N7000  [TO92-DGS]
Q53  2N7000  [TO92-DGS]
Q54  2N7000  [TO92-DGS]
Q55  2N7000  [TO92-DGS]
Q56  2N7000  [TO92-DGS]
Q57  2N7000  [TO92-DGS]
Q58  2N7000  [TO92-DGS]
R51  10k  R_P2INCH  [R_P2INCH]
R52  470  R_P2INCH  [R_P2INCH]
R53  10k  R_P2INCH  [R_P2INCH]
R54  470  R_P2INCH  [R_P2INCH]
R55  10k  R_P2INCH  [R_P2INCH]
R56  470  R_P2INCH  [R_P2INCH]
R57  10k  R_P2INCH  [R_P2INCH]
R58  470  R_P2INCH  [R_P2INCH]
R59  10k  R_P2INCH  [R_P2INCH]
R60  470  R_P2INCH  [R_P2INCH]
R61  10k  R_P2INCH  [R_P2INCH]
R62  470  R_P2INCH  [R_P2INCH]
R63  10k  R_P2INCH  [R_P2INCH]
R64  470  R_P2INCH  [R_P2INCH]
R65  10k  R_P2INCH  [R_P2INCH]
R66  470  R_P2INCH  [R_P2INCH]
R67  10k  R_P2INCH  [R_P2INCH]
R68  10k  R_P2INCH  [R_P2INCH]
R69  10k  R_P2INCH  [R_P2INCH]
R70  10k  R_P2INCH  [R_P2INCH]
R71  10k  R_P2INCH  [R_P2INCH]
R72  10k  R_P2INCH  [R_P2INCH]
R73  10k  R_P2INCH  [R_P2INCH]
R74  10k  R_P2INCH  [R_P2INCH]

### Nets
+5V: D9.A D10.A D11.A D12.A D13.A D14.A D15.A D16.A R51.2 R53.2 R55.2 R57.2 R59.2 R61.2 R63.2 R65.2 R67.2 R68.2 R69.2 R70.2 R71.2 R72.2 R73.2 R74.2 ; also sheet 2,3,4,5,6,7,9,10,11,12
CS_1_N: Q44.S Q46.S Q48.S Q50.S Q52.S Q54.S Q56.S Q58.S ; also sheet 3
GND: Q43.S Q45.S Q47.S Q49.S Q51.S Q53.S Q55.S Q57.S ; also sheet 2,3,4,5,6,7,9,10,11,12
N$11: Q43.D Q44.G R51.1 R52.1
N$18: D9.K(C) R52.2
N$19: Q45.D Q46.G R53.1 R54.1
N$20: D10.K(C) R54.2
N$21: Q47.D Q48.G R55.1 R56.1
N$22: D11.K(C) R56.2
N$23: Q49.D Q50.G R57.1 R58.1
N$24: D12.K(C) R58.2
N$25: Q51.D Q52.G R59.1 R60.1
N$26: D13.K(C) R60.2
N$27: Q53.D Q54.G R61.1 R62.1
N$28: D14.K(C) R62.2
N$29: Q55.D Q56.G R63.1 R64.1
N$30: D15.K(C) R64.2
N$31: Q57.D Q58.G R65.1 R66.1
N$32: D16.K(C) R66.2
P1_RD0: Q43.G ; also sheet 9
P1_RD0_B: Q44.D R67.1 ; also sheet 11
P1_RD1: Q45.G ; also sheet 9
P1_RD1_B: Q46.D R68.1 ; also sheet 11
P1_RD2: Q47.G ; also sheet 9
P1_RD2_B: Q48.D R69.1 ; also sheet 11
P1_RD3: Q49.G ; also sheet 9
P1_RD3_B: Q50.D R70.1 ; also sheet 11
P1_RD4: Q51.G ; also sheet 9
P1_RD4_B: Q52.D R71.1 ; also sheet 12
P1_RD5: Q53.G ; also sheet 9
P1_RD5_B: Q54.D R72.1 ; also sheet 12
P1_RD6: Q55.G ; also sheet 9
P1_RD6_B: Q56.D R73.1 ; also sheet 12
P1_RD7: Q57.G ; also sheet 9
P1_RD7_B: Q58.D R74.1 ; also sheet 12

## Sheet 9 of 12
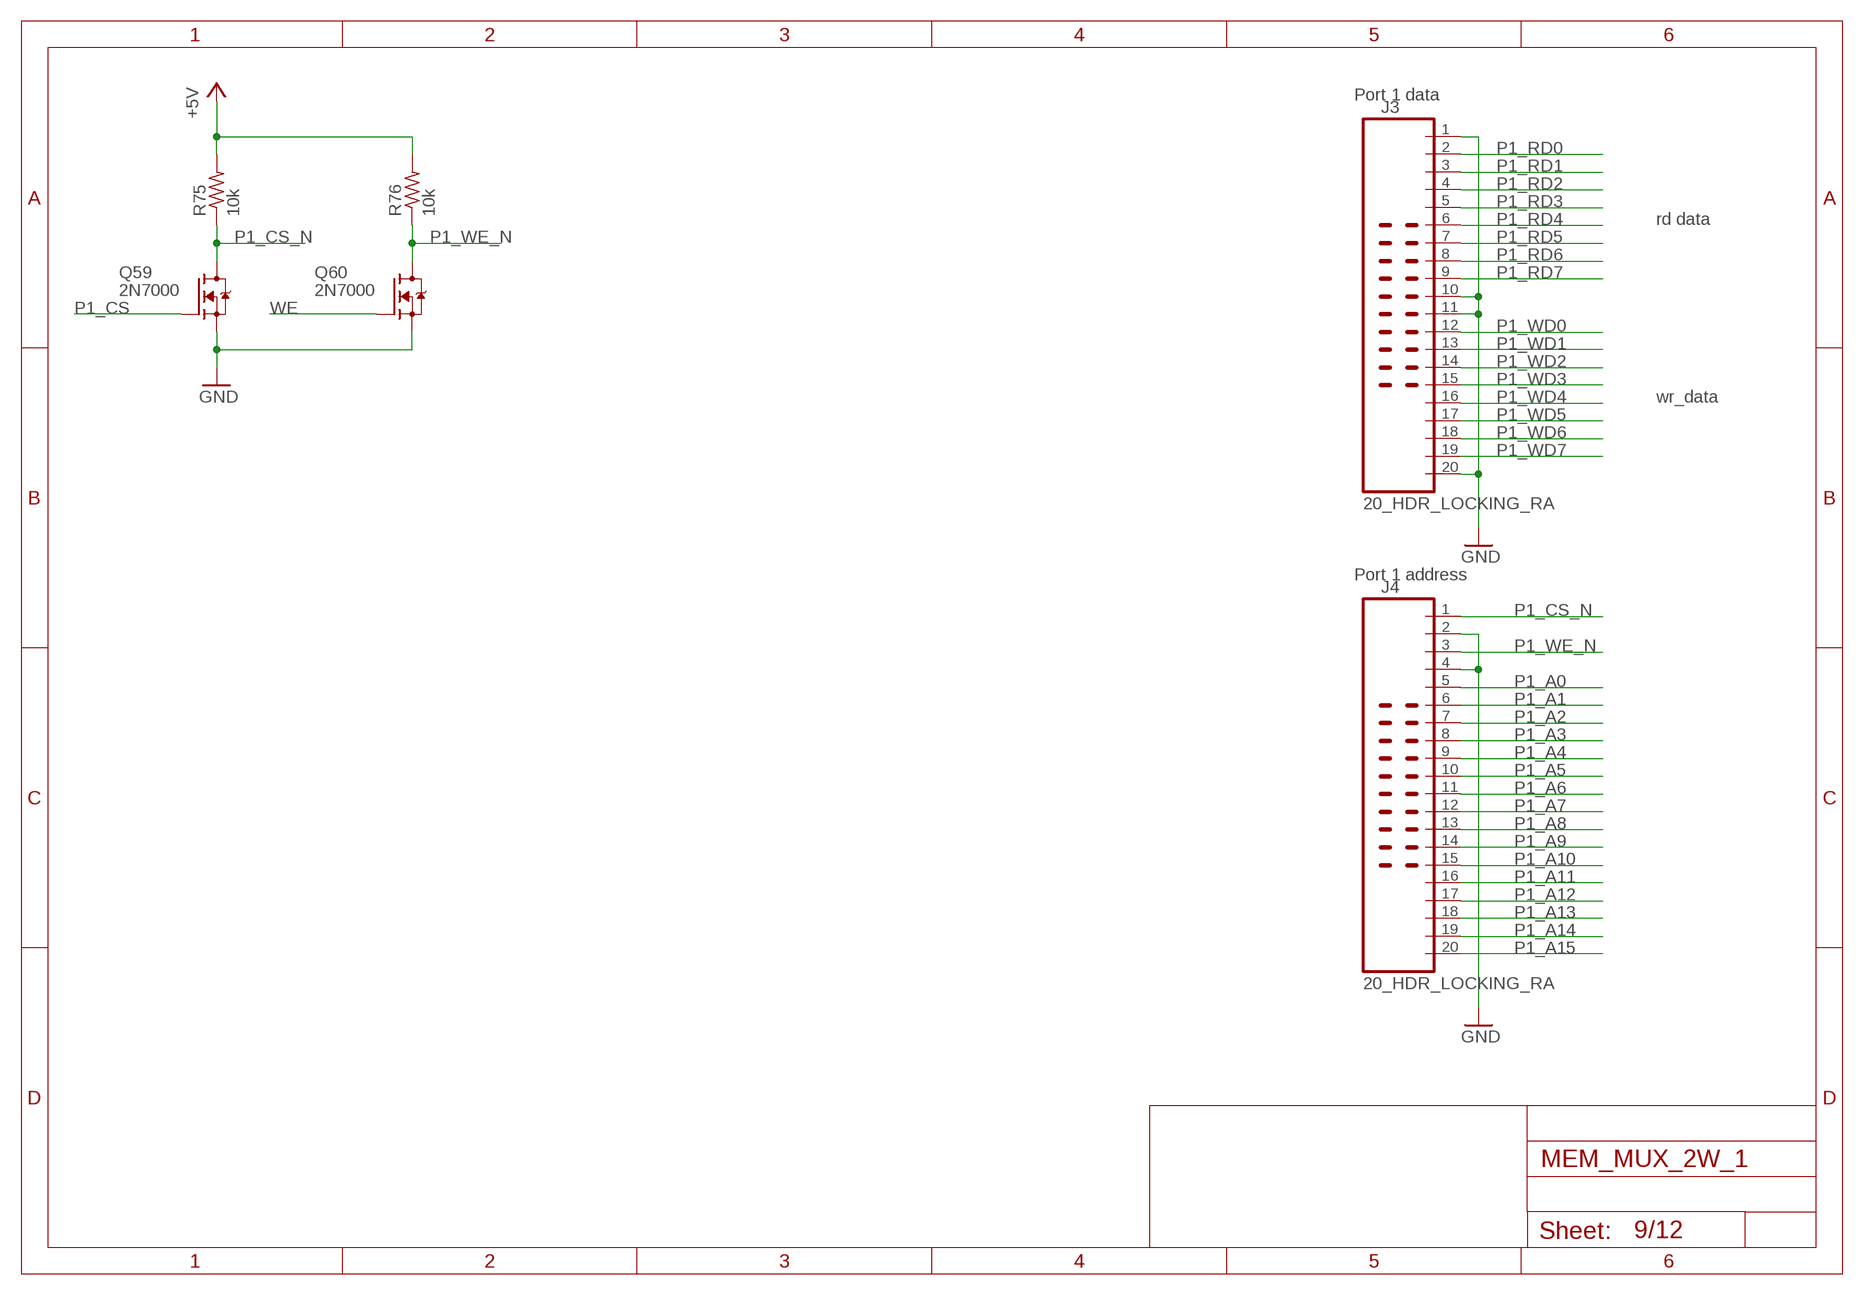
[diagram p8: schematic, sheet 9]

### Parts
J3  20_HDR_LOCKING_RA  [20_HDR_LOCKING_RA]
J4  20_HDR_LOCKING_RA  [20_HDR_LOCKING_RA]
Q59  2N7000  [TO92-DGS]
Q60  2N7000  [TO92-DGS]
R75  10k  R_P2INCH  [R_P2INCH]
R76  10k  R_P2INCH  [R_P2INCH]

### Nets
+5V: R75.2 R76.2 ; also sheet 2,3,4,5,6,7,8,10,11,12
GND: J3.1 J3.10 J3.11 J3.20 J4.2 J4.4 Q59.S Q60.S ; also sheet 2,3,4,5,6,7,8,10,11,12
P1_A0: J4.5 ; also sheet 10
P1_A1: J4.6 ; also sheet 10
P1_A2: J4.7 ; also sheet 10
P1_A3: J4.8 ; also sheet 10
P1_A4: J4.9 ; also sheet 10
P1_A5: J4.10 ; also sheet 10
P1_A6: J4.11 ; also sheet 10
P1_A7: J4.12 ; also sheet 10
P1_A8: J4.13 ; also sheet 10
P1_A9: J4.14 ; also sheet 10
P1_A10: J4.15 ; also sheet 10
P1_A11: J4.16 ; also sheet 10
P1_A12: J4.17 ; also sheet 10
P1_A13: J4.18 ; also sheet 10
P1_A14: J4.19 ; also sheet 10
P1_A15: J4.20 ; also sheet 10
P1_CS: Q59.G ; also sheet 3
P1_CS_N: J4.1 Q59.D R75.1
P1_RD0: J3.2 ; also sheet 8
P1_RD1: J3.3 ; also sheet 8
P1_RD2: J3.4 ; also sheet 8
P1_RD3: J3.5 ; also sheet 8
P1_RD4: J3.6 ; also sheet 8
P1_RD5: J3.7 ; also sheet 8
P1_RD6: J3.8 ; also sheet 8
P1_RD7: J3.9 ; also sheet 8
P1_WD0: J3.12 ; also sheet 10
P1_WD1: J3.13 ; also sheet 10
P1_WD2: J3.14 ; also sheet 10
P1_WD3: J3.15 ; also sheet 10
P1_WD4: J3.16 ; also sheet 10
P1_WD5: J3.17 ; also sheet 10
P1_WD6: J3.18 ; also sheet 10
P1_WD7: J3.19 ; also sheet 10
P1_WE_N: J4.3 Q60.D R76.1
WE: Q60.G ; also sheet 3,6

### Notes on the sheet
- Port 1 data
- rd data
- wr_data
- Port 1 address

## Sheet 10 of 12
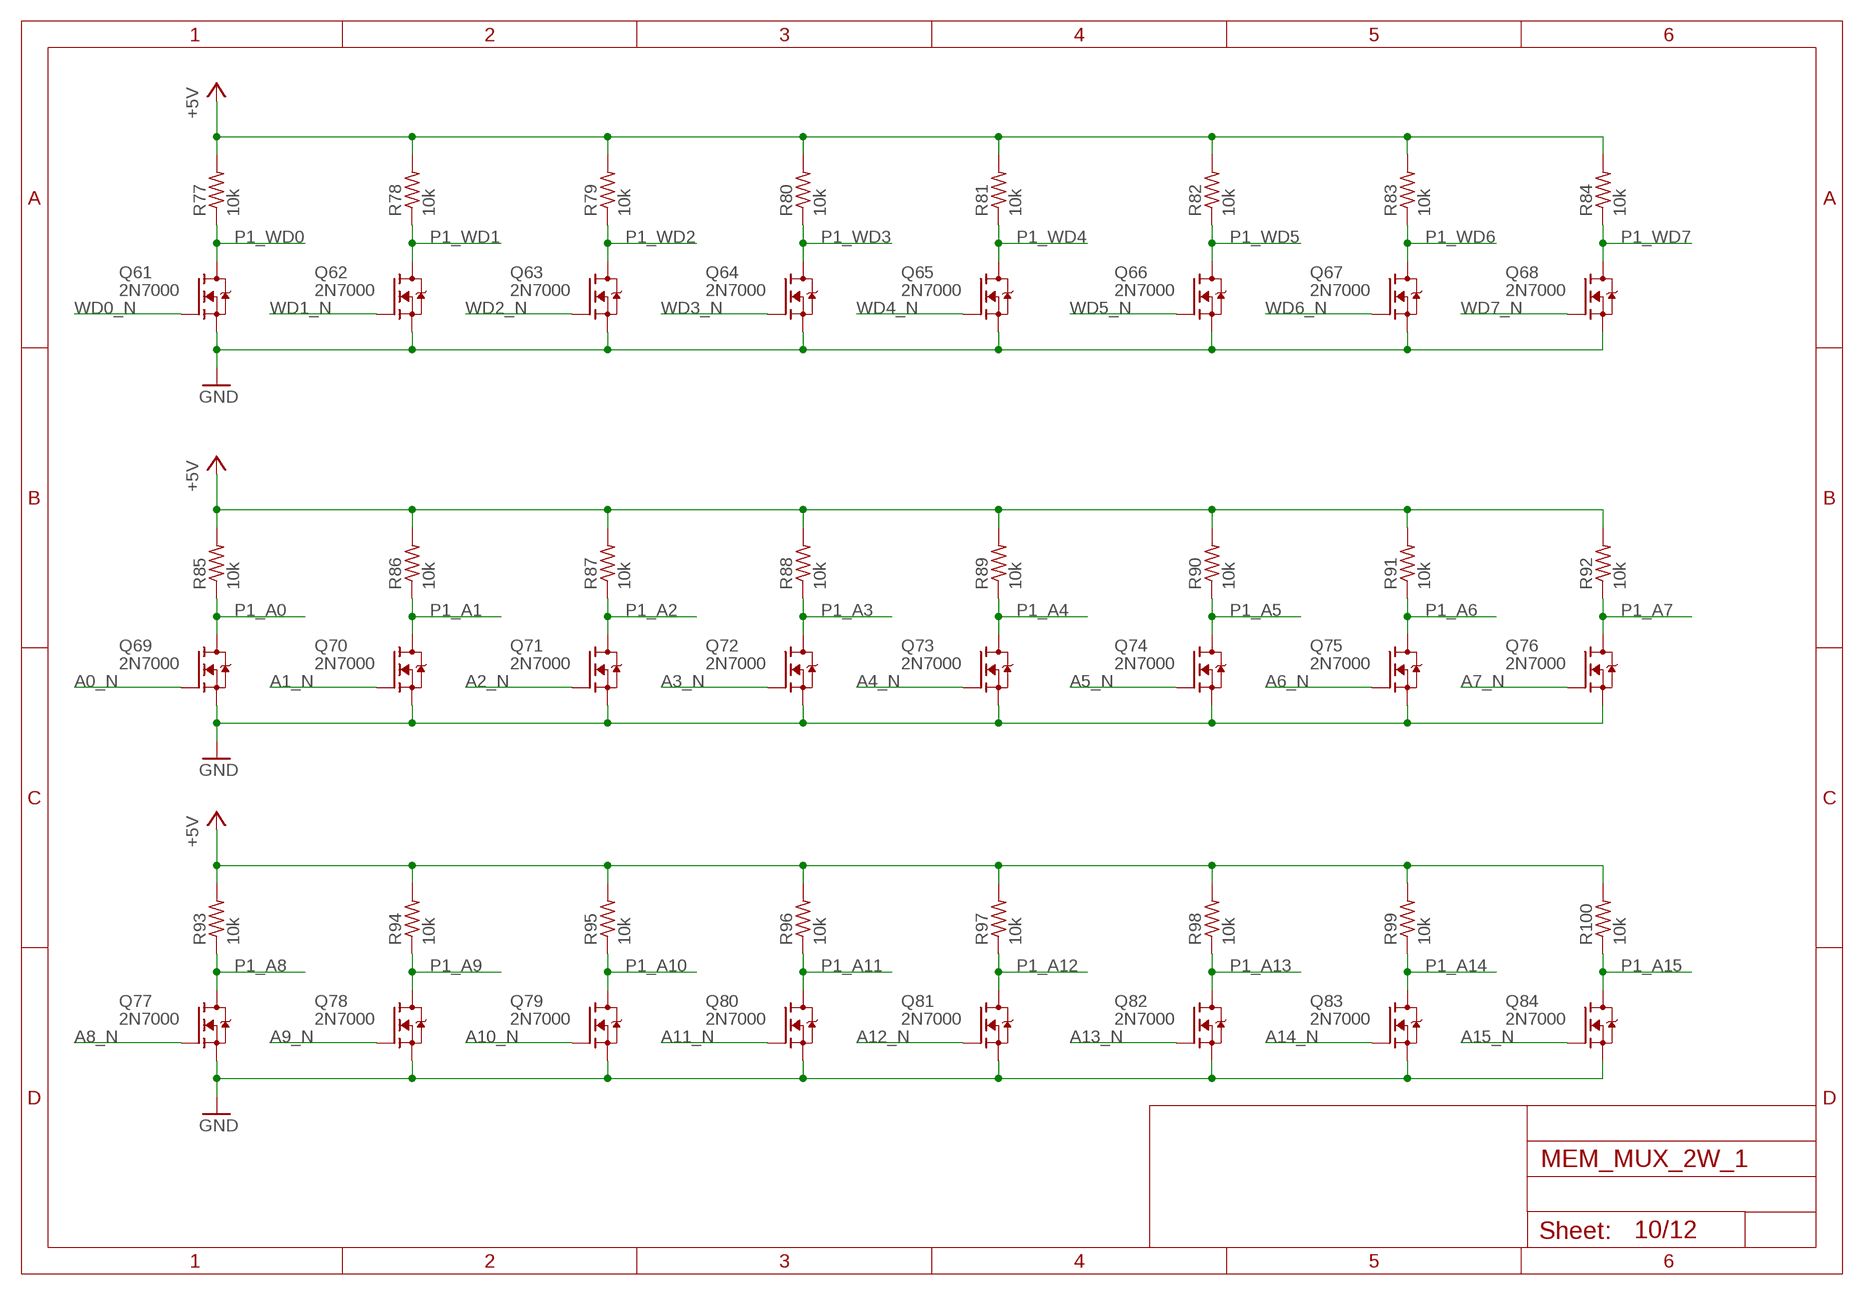
[diagram p9: schematic, sheet 10]

### Parts
Q61  2N7000  [TO92-DGS]
Q62  2N7000  [TO92-DGS]
Q63  2N7000  [TO92-DGS]
Q64  2N7000  [TO92-DGS]
Q65  2N7000  [TO92-DGS]
Q66  2N7000  [TO92-DGS]
Q67  2N7000  [TO92-DGS]
Q68  2N7000  [TO92-DGS]
Q69  2N7000  [TO92-DGS]
Q70  2N7000  [TO92-DGS]
Q71  2N7000  [TO92-DGS]
Q72  2N7000  [TO92-DGS]
Q73  2N7000  [TO92-DGS]
Q74  2N7000  [TO92-DGS]
Q75  2N7000  [TO92-DGS]
Q76  2N7000  [TO92-DGS]
Q77  2N7000  [TO92-DGS]
Q78  2N7000  [TO92-DGS]
Q79  2N7000  [TO92-DGS]
Q80  2N7000  [TO92-DGS]
Q81  2N7000  [TO92-DGS]
Q82  2N7000  [TO92-DGS]
Q83  2N7000  [TO92-DGS]
Q84  2N7000  [TO92-DGS]
R77  10k  R_P2INCH  [R_P2INCH]
R78  10k  R_P2INCH  [R_P2INCH]
R79  10k  R_P2INCH  [R_P2INCH]
R80  10k  R_P2INCH  [R_P2INCH]
R81  10k  R_P2INCH  [R_P2INCH]
R82  10k  R_P2INCH  [R_P2INCH]
R83  10k  R_P2INCH  [R_P2INCH]
R84  10k  R_P2INCH  [R_P2INCH]
R85  10k  R_P2INCH  [R_P2INCH]
R86  10k  R_P2INCH  [R_P2INCH]
R87  10k  R_P2INCH  [R_P2INCH]
R88  10k  R_P2INCH  [R_P2INCH]
R89  10k  R_P2INCH  [R_P2INCH]
R90  10k  R_P2INCH  [R_P2INCH]
R91  10k  R_P2INCH  [R_P2INCH]
R92  10k  R_P2INCH  [R_P2INCH]
R93  10k  R_P2INCH  [R_P2INCH]
R94  10k  R_P2INCH  [R_P2INCH]
R95  10k  R_P2INCH  [R_P2INCH]
R96  10k  R_P2INCH  [R_P2INCH]
R97  10k  R_P2INCH  [R_P2INCH]
R98  10k  R_P2INCH  [R_P2INCH]
R99  10k  R_P2INCH  [R_P2INCH]
R100  10k  R_P2INCH  [R_P2INCH]

### Nets
+5V: R77.2 R78.2 R79.2 R80.2 R81.2 R82.2 R83.2 R84.2 R85.2 R86.2 R87.2 R88.2 R89.2 R90.2 R91.2 R92.2 R93.2 R94.2 R95.2 R96.2 R97.2 R98.2 R99.2 R100.2 ; also sheet 2,3,4,5,6,7,8,9,11,12
A0_N: Q69.G ; also sheet 3,4,7
A1_N: Q70.G ; also sheet 3,4,7
A2_N: Q71.G ; also sheet 3,4,7
A3_N: Q72.G ; also sheet 3,4,7
A4_N: Q73.G ; also sheet 3,4,7
A5_N: Q74.G ; also sheet 3,4,7
A6_N: Q75.G ; also sheet 3,4,7
A7_N: Q76.G ; also sheet 3,4,7
A8_N: Q77.G ; also sheet 3,4,7
A9_N: Q78.G ; also sheet 3,4,7
A10_N: Q79.G ; also sheet 3,4,7
A11_N: Q80.G ; also sheet 3,4,7
A12_N: Q81.G ; also sheet 3,4,7
A13_N: Q82.G ; also sheet 3,4,7
A14_N: Q83.G ; also sheet 3,4,7
A15_N: Q84.G ; also sheet 3,4,7
GND: Q61.S Q62.S Q63.S Q64.S Q65.S Q66.S Q67.S Q68.S Q69.S Q70.S Q71.S Q72.S Q73.S Q74.S Q75.S Q76.S Q77.S Q78.S Q79.S Q80.S Q81.S Q82.S Q83.S Q84.S ; also sheet 2,3,4,5,6,7,8,9,11,12
P1_A0: Q69.D R85.1 ; also sheet 9
P1_A1: Q70.D R86.1 ; also sheet 9
P1_A2: Q71.D R87.1 ; also sheet 9
P1_A3: Q72.D R88.1 ; also sheet 9
P1_A4: Q73.D R89.1 ; also sheet 9
P1_A5: Q74.D R90.1 ; also sheet 9
P1_A6: Q75.D R91.1 ; also sheet 9
P1_A7: Q76.D R92.1 ; also sheet 9
P1_A8: Q77.D R93.1 ; also sheet 9
P1_A9: Q78.D R94.1 ; also sheet 9
P1_A10: Q79.D R95.1 ; also sheet 9
P1_A11: Q80.D R96.1 ; also sheet 9
P1_A12: Q81.D R97.1 ; also sheet 9
P1_A13: Q82.D R98.1 ; also sheet 9
P1_A14: Q83.D R99.1 ; also sheet 9
P1_A15: Q84.D R100.1 ; also sheet 9
P1_WD0: Q61.D R77.1 ; also sheet 9
P1_WD1: Q62.D R78.1 ; also sheet 9
P1_WD2: Q63.D R79.1 ; also sheet 9
P1_WD3: Q64.D R80.1 ; also sheet 9
P1_WD4: Q65.D R81.1 ; also sheet 9
P1_WD5: Q66.D R82.1 ; also sheet 9
P1_WD6: Q67.D R83.1 ; also sheet 9
P1_WD7: Q68.D R84.1 ; also sheet 9
WD0_N: Q61.G ; also sheet 4,7
WD1_N: Q62.G ; also sheet 4,7
WD2_N: Q63.G ; also sheet 4,7
WD3_N: Q64.G ; also sheet 4,7
WD4_N: Q65.G ; also sheet 4,7
WD5_N: Q66.G ; also sheet 4,7
WD6_N: Q67.G ; also sheet 4,7
WD7_N: Q68.G ; also sheet 4,7

## Sheet 11 of 12
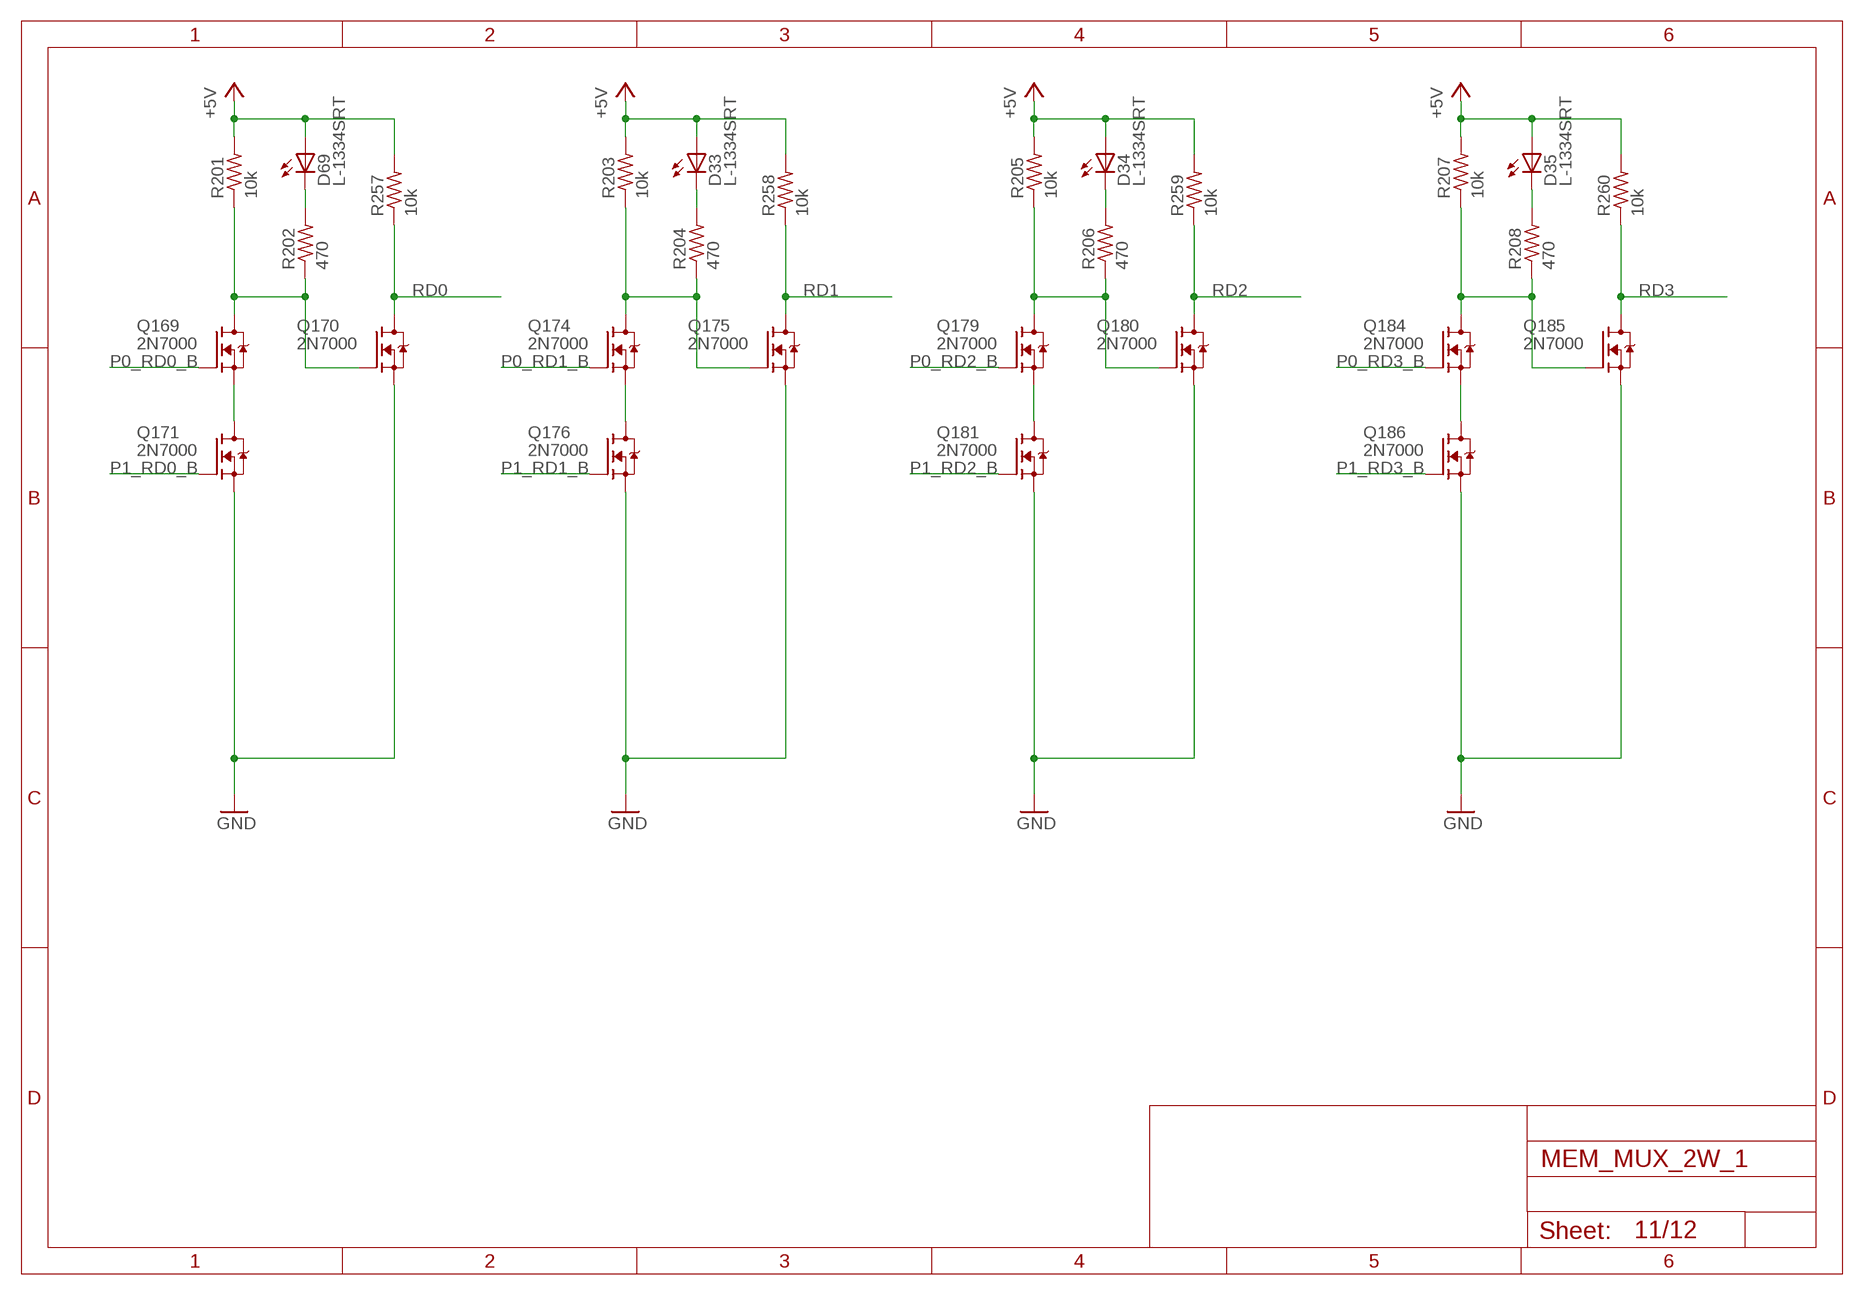
[diagram p10: schematic, sheet 11]

### Parts
D33  L-1334SRT  [LED3MM]
D34  L-1334SRT  [LED3MM]
D35  L-1334SRT  [LED3MM]
D69  L-1334SRT  [LED3MM]
Q169  2N7000  [TO92-DGS]
Q170  2N7000  [TO92-DGS]
Q171  2N7000  [TO92-DGS]
Q174  2N7000  [TO92-DGS]
Q175  2N7000  [TO92-DGS]
Q176  2N7000  [TO92-DGS]
Q179  2N7000  [TO92-DGS]
Q180  2N7000  [TO92-DGS]
Q181  2N7000  [TO92-DGS]
Q184  2N7000  [TO92-DGS]
Q185  2N7000  [TO92-DGS]
Q186  2N7000  [TO92-DGS]
R201  10k  R_P2INCH  [R_P2INCH]
R202  470  R_P2INCH  [R_P2INCH]
R203  10k  R_P2INCH  [R_P2INCH]
R204  470  R_P2INCH  [R_P2INCH]
R205  10k  R_P2INCH  [R_P2INCH]
R206  470  R_P2INCH  [R_P2INCH]
R207  10k  R_P2INCH  [R_P2INCH]
R208  470  R_P2INCH  [R_P2INCH]
R257  10k  R_P2INCH  [R_P2INCH]
R258  10k  R_P2INCH  [R_P2INCH]
R259  10k  R_P2INCH  [R_P2INCH]
R260  10k  R_P2INCH  [R_P2INCH]

### Nets
+5V: D33.A D34.A D35.A D69.A R201.2 R203.2 R205.2 R207.2 R257.2 R258.2 R259.2 R260.2 ; also sheet 2,3,4,5,6,7,8,9,10,12
GND: Q170.S Q171.S Q175.S Q176.S Q180.S Q181.S Q185.S Q186.S ; also sheet 2,3,4,5,6,7,8,9,10,12
N$65: Q174.D Q175.G R203.1 R204.1
N$66: D33.K(C) R204.2
N$69: Q174.S Q176.D
N$70: Q179.D Q180.G R205.1 R206.1
N$71: D34.K(C) R206.2
N$74: Q179.S Q181.D
N$75: Q184.D Q185.G R207.1 R208.1
N$76: D35.K(C) R208.2
N$79: Q184.S Q186.D
N$133: Q169.D Q170.G R201.1 R202.1
N$134: D69.K(C) R202.2
N$137: Q169.S Q171.D
P0_RD0_B: Q169.G ; also sheet 5
P0_RD1_B: Q174.G ; also sheet 5
P0_RD2_B: Q179.G ; also sheet 5
P0_RD3_B: Q184.G ; also sheet 5
P1_RD0_B: Q171.G ; also sheet 8
P1_RD1_B: Q176.G ; also sheet 8
P1_RD2_B: Q181.G ; also sheet 8
P1_RD3_B: Q186.G ; also sheet 8
RD0: Q170.D R257.1 ; also sheet 3
RD1: Q175.D R258.1 ; also sheet 3
RD2: Q180.D R259.1 ; also sheet 3
RD3: Q185.D R260.1 ; also sheet 3

## Sheet 12 of 12
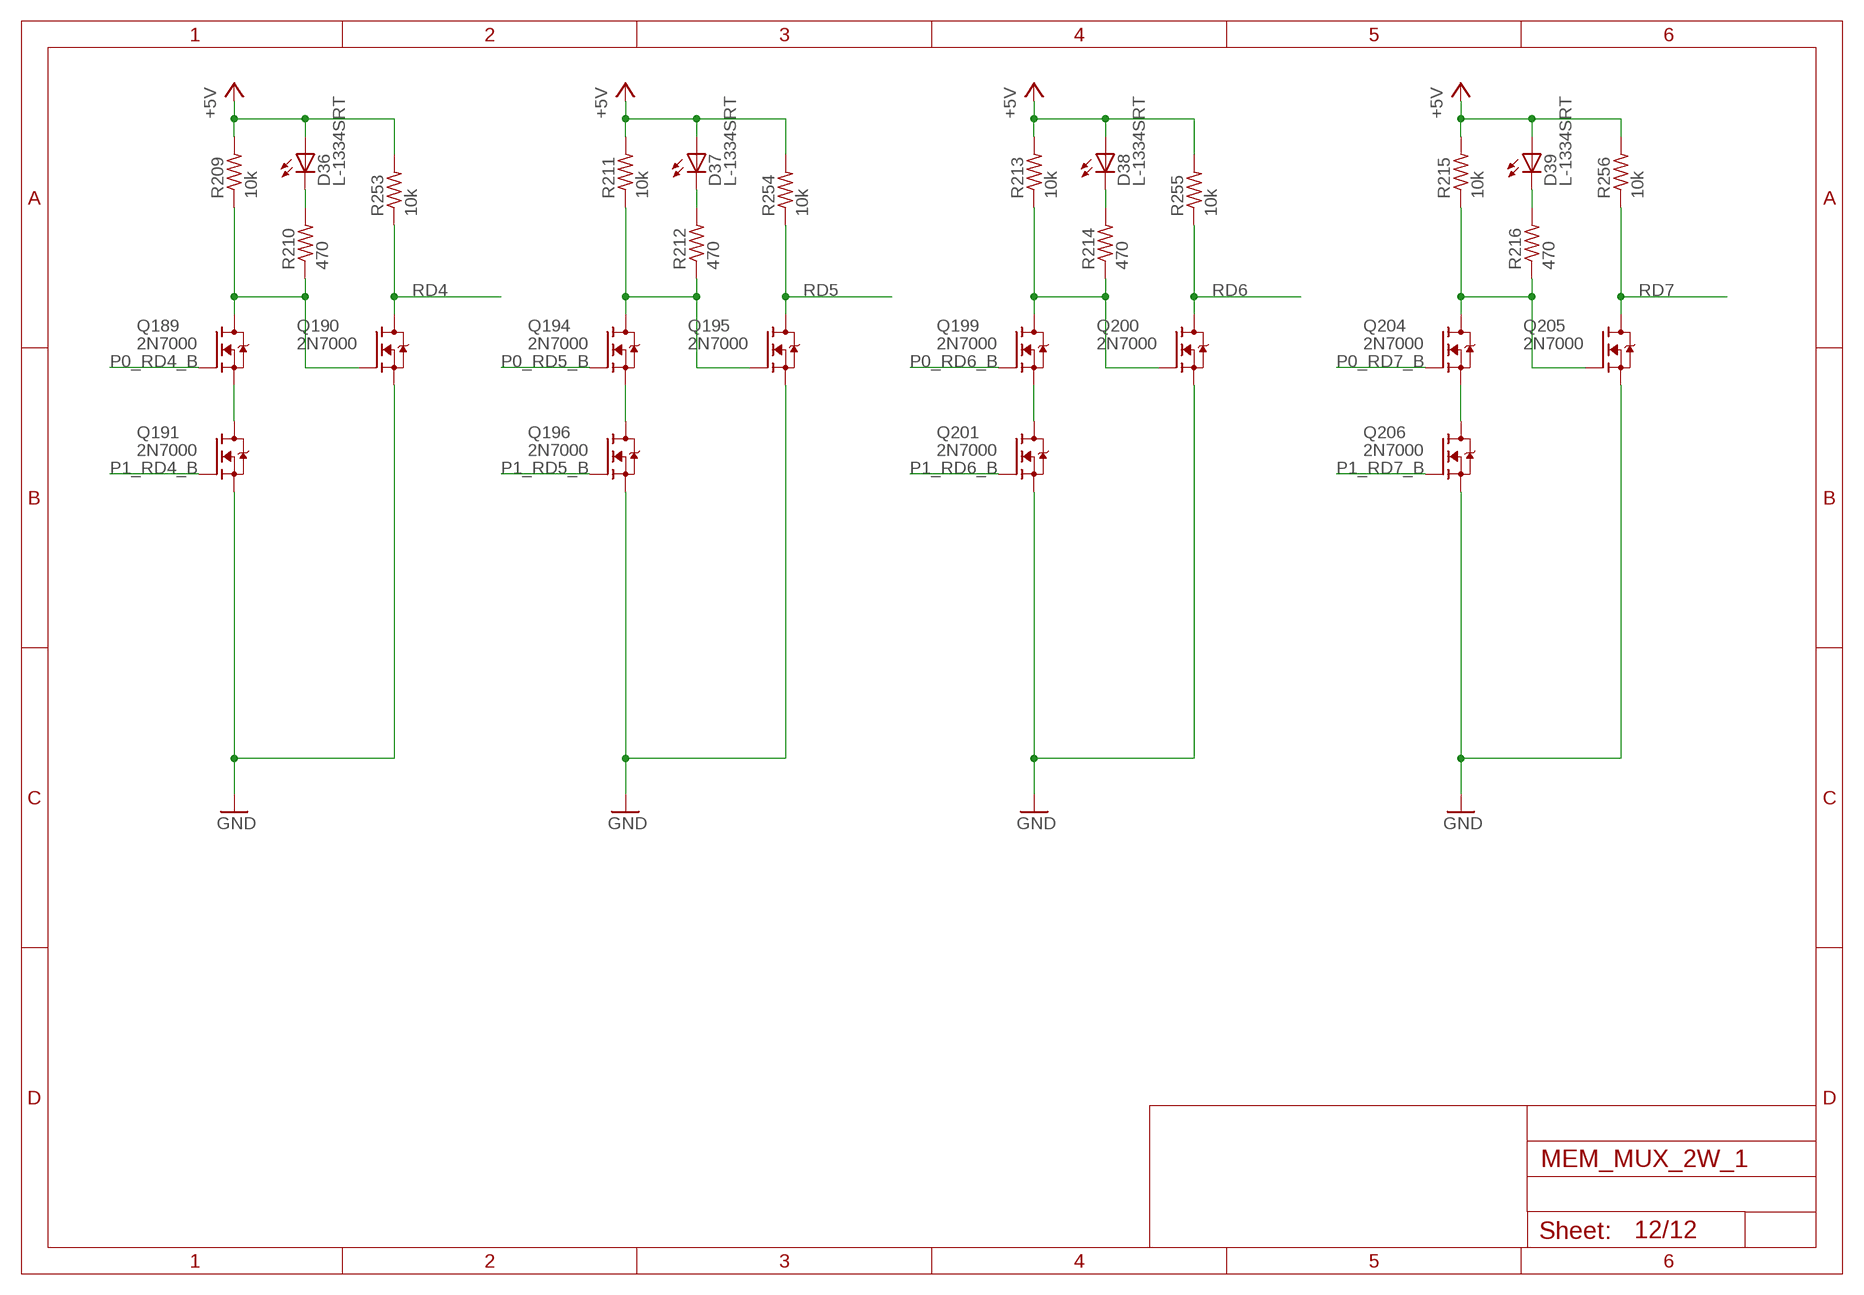
[diagram p11: schematic, sheet 12]

### Parts
D36  L-1334SRT  [LED3MM]
D37  L-1334SRT  [LED3MM]
D38  L-1334SRT  [LED3MM]
D39  L-1334SRT  [LED3MM]
Q189  2N7000  [TO92-DGS]
Q190  2N7000  [TO92-DGS]
Q191  2N7000  [TO92-DGS]
Q194  2N7000  [TO92-DGS]
Q195  2N7000  [TO92-DGS]
Q196  2N7000  [TO92-DGS]
Q199  2N7000  [TO92-DGS]
Q200  2N7000  [TO92-DGS]
Q201  2N7000  [TO92-DGS]
Q204  2N7000  [TO92-DGS]
Q205  2N7000  [TO92-DGS]
Q206  2N7000  [TO92-DGS]
R209  10k  R_P2INCH  [R_P2INCH]
R210  470  R_P2INCH  [R_P2INCH]
R211  10k  R_P2INCH  [R_P2INCH]
R212  470  R_P2INCH  [R_P2INCH]
R213  10k  R_P2INCH  [R_P2INCH]
R214  470  R_P2INCH  [R_P2INCH]
R215  10k  R_P2INCH  [R_P2INCH]
R216  470  R_P2INCH  [R_P2INCH]
R253  10k  R_P2INCH  [R_P2INCH]
R254  10k  R_P2INCH  [R_P2INCH]
R255  10k  R_P2INCH  [R_P2INCH]
R256  10k  R_P2INCH  [R_P2INCH]

### Nets
+5V: D36.A D37.A D38.A D39.A R209.2 R211.2 R213.2 R215.2 R253.2 R254.2 R255.2 R256.2 ; also sheet 2,3,4,5,6,7,8,9,10,11
GND: Q190.S Q191.S Q195.S Q196.S Q200.S Q201.S Q205.S Q206.S ; also sheet 2,3,4,5,6,7,8,9,10,11
N$80: Q189.D Q190.G R209.1 R210.1
N$81: D36.K(C) R210.2
N$84: Q189.S Q191.D
N$85: Q194.D Q195.G R211.1 R212.1
N$86: D37.K(C) R212.2
N$89: Q194.S Q196.D
N$90: Q199.D Q200.G R213.1 R214.1
N$91: D38.K(C) R214.2
N$94: Q199.S Q201.D
N$95: Q204.D Q205.G R215.1 R216.1
N$96: D39.K(C) R216.2
N$99: Q204.S Q206.D
P0_RD4_B: Q189.G ; also sheet 5
P0_RD5_B: Q194.G ; also sheet 5
P0_RD6_B: Q199.G ; also sheet 5
P0_RD7_B: Q204.G ; also sheet 5
P1_RD4_B: Q191.G ; also sheet 8
P1_RD5_B: Q196.G ; also sheet 8
P1_RD6_B: Q201.G ; also sheet 8
P1_RD7_B: Q206.G ; also sheet 8
RD4: Q190.D R253.1 ; also sheet 3
RD5: Q195.D R254.1 ; also sheet 3
RD6: Q200.D R255.1 ; also sheet 3
RD7: Q205.D R256.1 ; also sheet 3

## Library data of the parts
C1-C6 = MyLib:C_P2INCH
C7 = MyLib:POLARISED_CAP_2P5_6P3MM
D1-D16 D33-D39 D69 = MyLib:L-1334SRT
H2 H3 H5 H6 H9 H10 = MyLib:3M_MOUNT_HOLE
J1-J4 J9 J10 = MyLib:20_HDR_LOCKING_RA
J12 = MyLib:JUMP_16X1
Q1-Q84 Q169-Q171 Q174-Q176 Q179-Q181 Q184-Q186 Q189-Q191 Q194-Q196 Q199-Q201 Q204-Q206 Q209-Q233 Q235-Q237 Q239-Q241 Q243 Q244 = MyLib:2N7000
R1-R100 R201-R241 R243-R248 R253-R260 = MyLib:R_P2INCH
TP1 = MyLib:TEST_LOOP
TP5 TP6 = MyLib:POWER_PAD